# EAGLE design boneclamp_rC (EAGLE 6.4)

## Sheet 1 of 6: Beaglebone interface
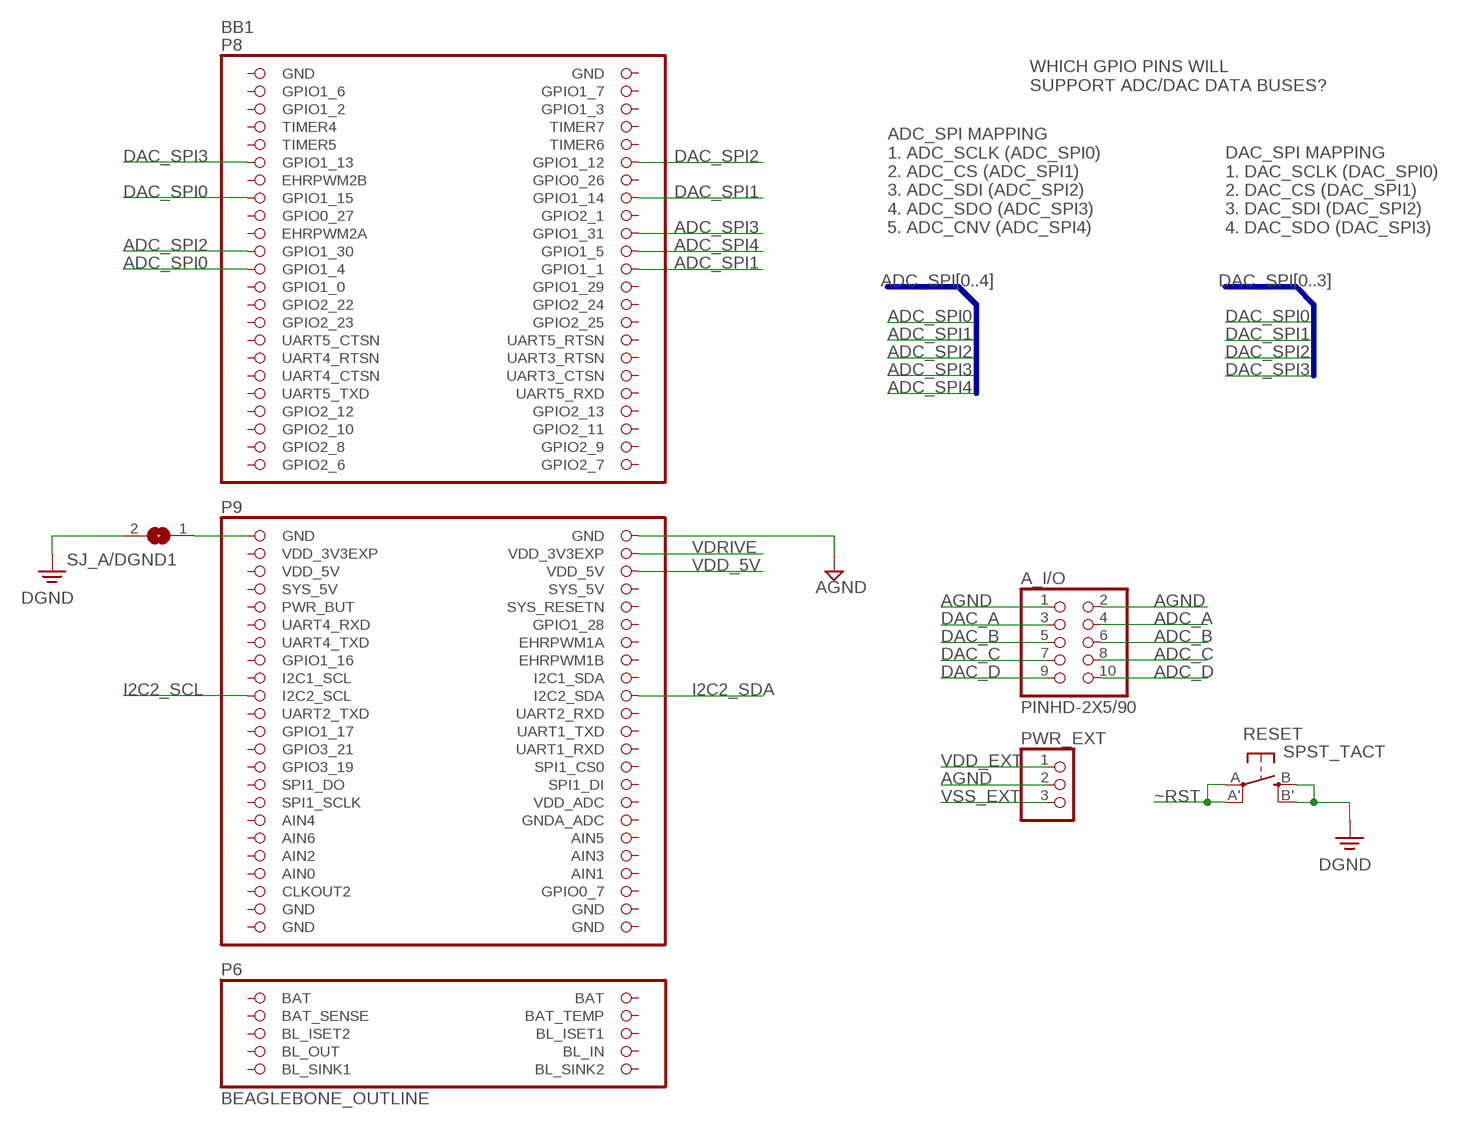
[diagram p0: schematic, sheet 1]

### Parts
A_I/O  PINHD-2X5/90  [2X05/90]
BB1  BEAGLEBONE_OUTLINE  [BEAGLEBONE_SHIELD]
PWR_EXT  PINHD-1X3  [1X03]
RESET  SPST_TACT  [EVQ-Q2-A]
SJ_A/DGND1  SJ  [SJ]

### Nets
ADC_A: A_I/O.4 ; also sheet 2
ADC_B: A_I/O.6 ; also sheet 2
ADC_C: A_I/O.8 ; also sheet 2
ADC_D: A_I/O.10 ; also sheet 2
ADC_SPI0: BB1.23(GPIO1_4) ; also sheet 2
ADC_SPI1: BB1.24(GPIO1_1) ; also sheet 2
ADC_SPI2: BB1.21(GPIO1_30) ; also sheet 2
ADC_SPI3: BB1.20(GPIO1_31) ; also sheet 2
ADC_SPI4: BB1.22(GPIO1_5) ; also sheet 2
AGND: A_I/O.1 A_I/O.2 BB1.48(GND) PWR_EXT.2 ; also sheet 2,3,4,5
DAC_A: A_I/O.3 ; also sheet 3
DAC_B: A_I/O.5 ; also sheet 3
DAC_C: A_I/O.7 ; also sheet 3
DAC_D: A_I/O.9 ; also sheet 3
DAC_SPI0: BB1.15(GPIO1_15) ; also sheet 3
DAC_SPI1: BB1.16(GPIO1_14) ; also sheet 3
DAC_SPI2: BB1.12(GPIO1_12) ; also sheet 3
DAC_SPI3: BB1.11(GPIO1_13) ; also sheet 3
DGND: RESET.B'(S1) RESET.B(S) SJ_A/DGND1.2 ; also sheet 2,3,4,6
I2C2_SCL: BB1.65(I2C2_SCL) ; also sheet 6
I2C2_SDA: BB1.66(I2C2_SDA) ; also sheet 6
N$8: BB1.47(GND) SJ_A/DGND1.1
VDD_5V: BB1.52(VDD_5V) ; also sheet 4
VDD_EXT: PWR_EXT.1 ; also sheet 4
VDRIVE: BB1.50(VDD_3V3EXP) ; also sheet 2,3,6
VSS_EXT: PWR_EXT.3 ; also sheet 4
~RST: RESET.A'(P1) RESET.A(P) ; also sheet 2,3
Unconnected: BB1.3(GPIO1_6) BB1.4(GPIO1_7) BB1.5(GPIO1_2) BB1.6(GPIO1_3) BB1.7(TIMER4) BB1.8(TIMER7) BB1.9(TIMER5) BB1.10(TIMER6) BB1.13(EHRPWM2B) BB1.14(GPIO0_26) BB1.17(GPIO0_27) BB1.18(GPIO2_1) BB1.19(EHRPWM2A) BB1.25(GPIO1_0) BB1.26(GPIO1_29) BB1.27(GPIO2_22) BB1.28(GPIO2_24) BB1.29(GPIO2_23) BB1.30(GPIO2_25) BB1.31(UART5_CTSN) BB1.32(UART5_RTSN) BB1.33(UART4_RTSN) BB1.34(UART3_RTSN) BB1.35(UART4_CTSN) BB1.36(UART3_CTSN) BB1.37(UART5_TXD) BB1.38(UART5_RXD) BB1.39(GPIO2_12) BB1.40(GPIO2_13) BB1.41(GPIO2_10) BB1.42(GPIO2_11) BB1.43(GPIO2_8) BB1.44(GPIO2_9) BB1.45(GPIO2_6) BB1.46(GPIO2_7) BB1.54(SYS_5V) BB1.55(PWR_BUT) BB1.56(SYS_RESETN) BB1.57(UART4_RXD) BB1.58(GPIO1_28) BB1.59(UART4_TXD) BB1.60(EHRPWM1A) BB1.61(GPIO1_16) BB1.62(EHRPWM1B) BB1.63(I2C1_SCL) BB1.64(I2C1_SDA) BB1.67(UART2_TXD) BB1.68(UART2_RXD) BB1.69(GPIO1_17) BB1.70(UART1_TXD) BB1.71(GPIO3_21) BB1.72(UART1_RXD) BB1.73(GPIO3_19) BB1.74(SPI1_CS0) BB1.75(SPI1_DO) BB1.76(SPI1_DI) BB1.77(SPI1_SCLK) BB1.78(VDD_ADC) BB1.79(AIN4) BB1.80(GNDA_ADC) BB1.81(AIN6) BB1.82(AIN5) BB1.83(AIN2) BB1.84(AIN3) BB1.86(AIN1) BB1.87(CLKOUT2) BB1.88(GPIO0_7) BB1.93(BAT) BB1.94(BAT) BB1.96(BAT_TEMP) BB1.98(BL_ISET1) BB1.99(BL_ISET2)

### Buses
ADC_SPI[0..4]
DAC_SPI[0..3]

### Notes on the sheet
- WHICH GPIO PINS WILL 
  SUPPORT ADC/DAC DATA BUSES?
- ADC_SPI MAPPING
  1. ADC_SCLK (ADC_SPI0)
  2. ADC_CS (ADC_SPI1)
  3. ADC_SDI (ADC_SPI2)
  4. ADC_SDO (ADC_SPI3)
  5. ADC_CNV (ADC_SPI4)
- DAC_SPI MAPPING
  1. DAC_SCLK (DAC_SPI0)
  2. DAC_CS (DAC_SPI1)
  3. DAC_SDI (DAC_SPI2)
  4. DAC_SDO (DAC_SPI3)

## Sheet 2 of 6: ADC
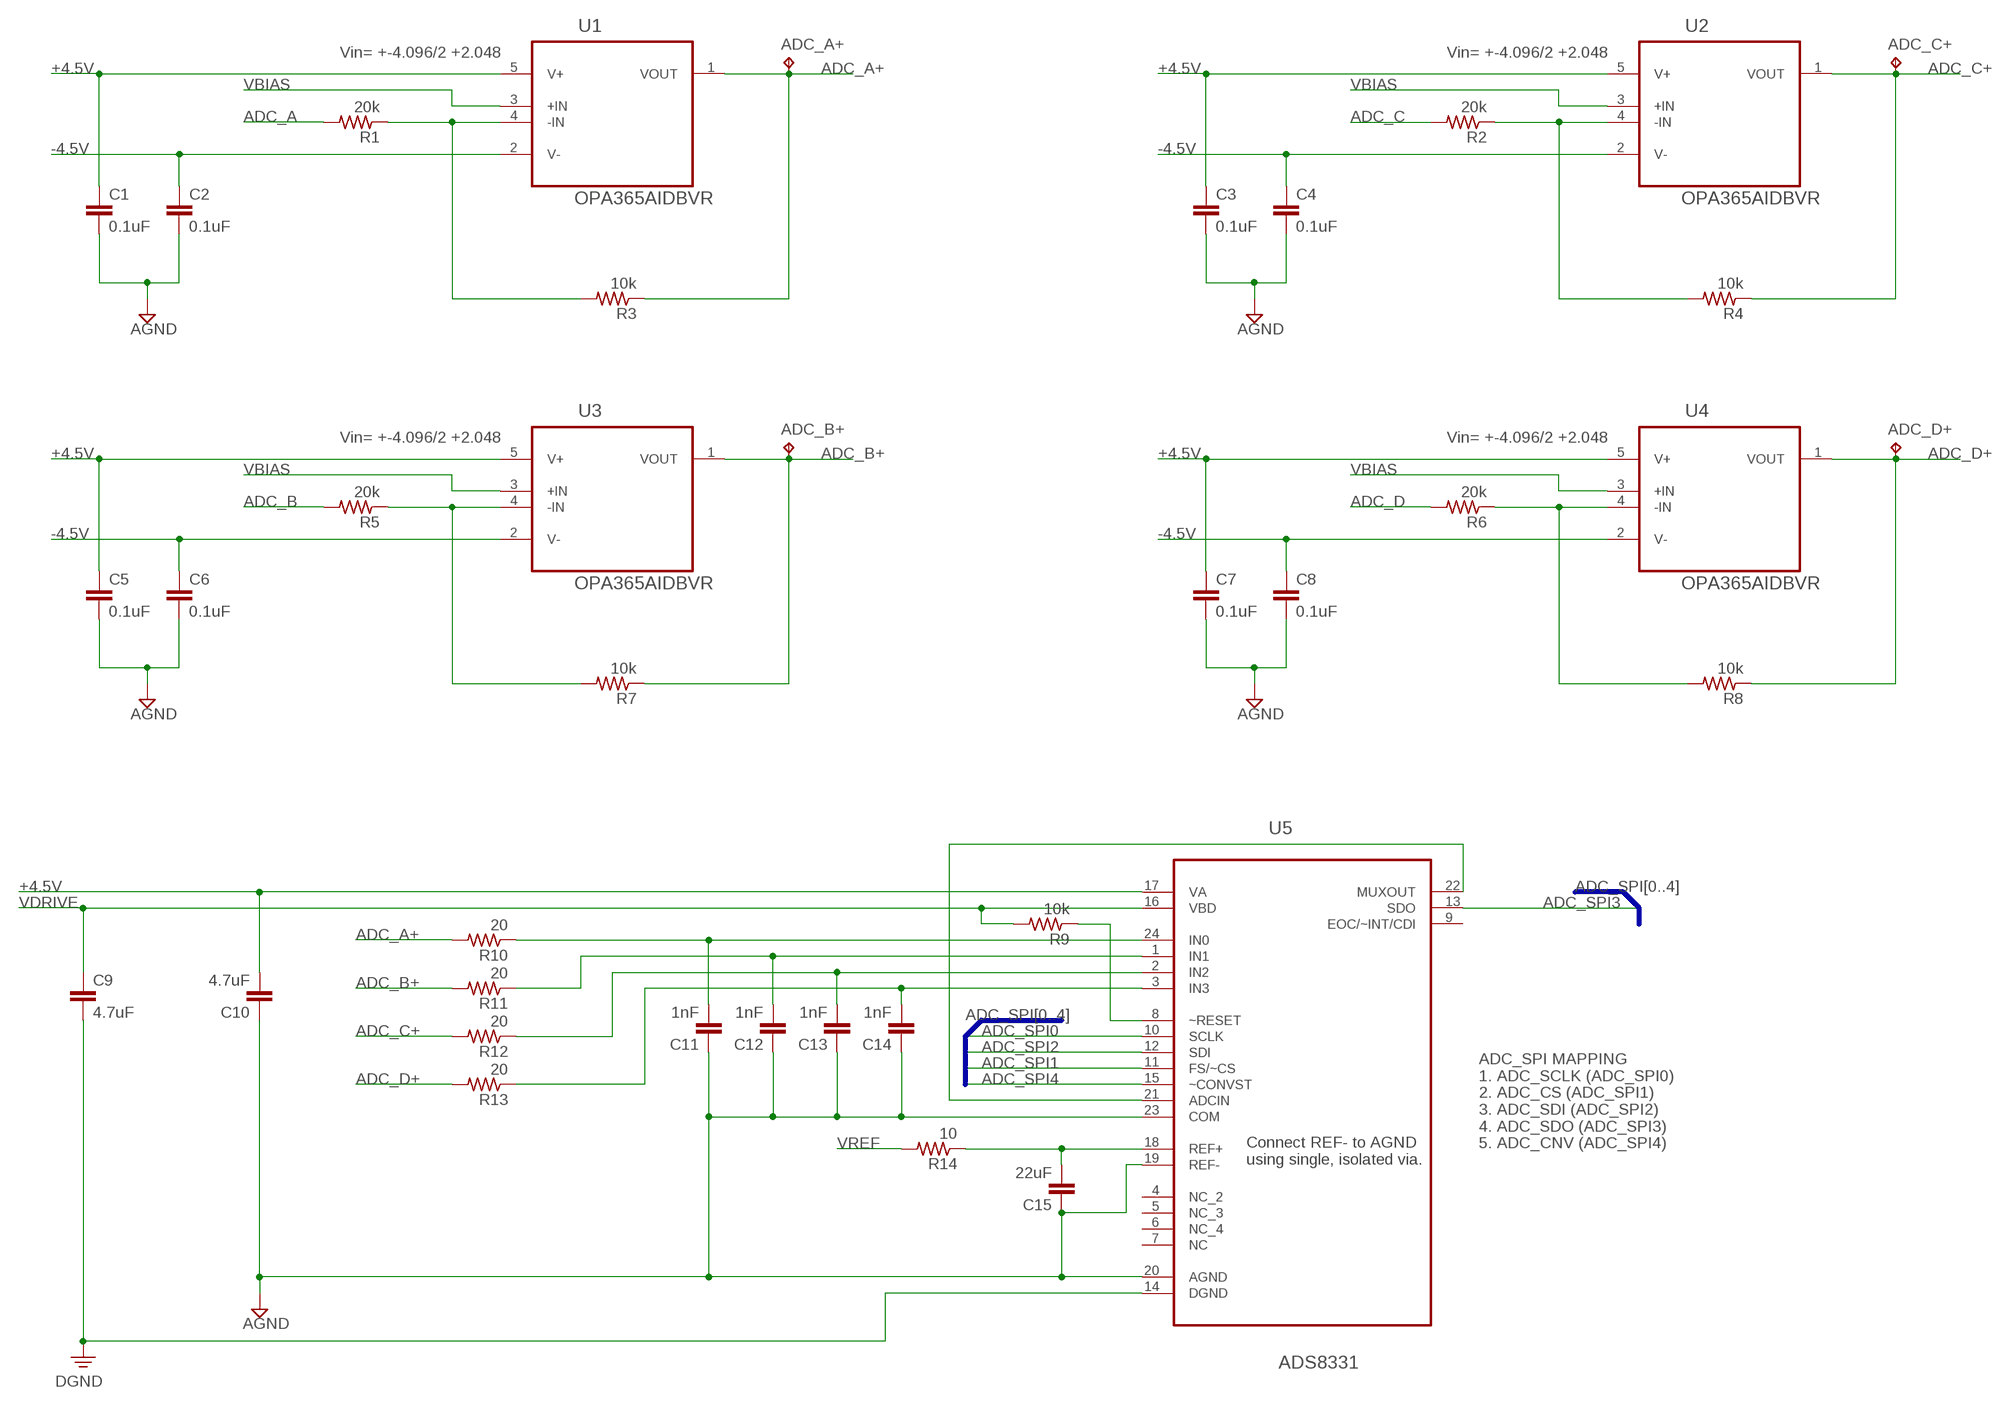
[diagram p1: schematic, sheet 2]

### Parts
ADC_A+  TPB1,27  [B1,27]
ADC_B+  TPB1,27  [B1,27]
ADC_C+  TPB1,27  [B1,27]
ADC_D+  TPB1,27  [B1,27]
C1  0.1uF  C-EUC0603  [C0603]
C2  0.1uF  C-EUC0603  [C0603]
C3  0.1uF  C-EUC0603  [C0603]
C4  0.1uF  C-EUC0603  [C0603]
C5  0.1uF  C-EUC0603  [C0603]
C6  0.1uF  C-EUC0603  [C0603]
C7  0.1uF  C-EUC0603  [C0603]
C8  0.1uF  C-EUC0603  [C0603]
C9  4.7uF  C-EUC0805  [C0805]
C10  4.7uF  C-EUC0805  [C0805]
C11  1nF  C-EUC0603  [C0603]
C12  1nF  C-EUC0603  [C0603]
C13  1nF  C-EUC0603  [C0603]
C14  1nF  C-EUC0603  [C0603]
C15  22uF  C-EUC0603  [C0603]
R1  20k  R-US_R0603  [R0603]
R2  20k  R-US_R0603  [R0603]
R3  10k  R-US_R0603  [R0603]
R4  10k  R-US_R0603  [R0603]
R5  20k  R-US_R0603  [R0603]
R6  20k  R-US_R0603  [R0603]
R7  10k  R-US_R0603  [R0603]
R8  10k  R-US_R0603  [R0603]
R9  10k  R-US_R0603  [R0603]
R10  20  R-US_R0603  [R0603]
R11  20  R-US_R0603  [R0603]
R12  20  R-US_R0603  [R0603]
R13  20  R-US_R0603  [R0603]
R14  10  R-US_R0603  [R0603]
U1  OPA365AIDBVR  [SOT95P280X145-5N]
U2  OPA365AIDBVR  [SOT95P280X145-5N]
U3  OPA365AIDBVR  [SOT95P280X145-5N]
U4  OPA365AIDBVR  [SOT95P280X145-5N]
U5  ADS8331  ADS8331IBPW  [SOP65P640X120-24N]

### Nets
+4.5V: C1.1 C3.1 C5.1 C7.1 C10.2 U1.5(V+) U2.5(V+) U3.5(V+) U4.5(V+) U5.17(VA) ; also sheet 3,4,5
-4.5V: C2.1 C4.1 C6.1 C8.1 U1.2(V-) U2.2(V-) U3.2(V-) U4.2(V-) ; also sheet 3,4
ADC_A: R1.2 ; also sheet 1
ADC_A+: ADC_A+.TP R3.1 R10.2 U1.1(VOUT)
ADC_B: R5.2 ; also sheet 1
ADC_B+: ADC_B+.TP R7.1 R11.2 U3.1(VOUT)
ADC_C: R2.2 ; also sheet 1
ADC_C+: ADC_C+.TP R4.1 R12.2 U2.1(VOUT)
ADC_D: R6.2 ; also sheet 1
ADC_D+: ADC_D+.TP R8.1 R13.2 U4.1(VOUT)
ADC_SPI0: U5.10(SCLK) ; also sheet 1
ADC_SPI1: U5.11(FS/~CS) ; also sheet 1
ADC_SPI2: U5.12(SDI) ; also sheet 1
ADC_SPI3: U5.13(SDO) ; also sheet 1
ADC_SPI4: U5.15(~CONVST) ; also sheet 1
AGND: C1.2 C2.2 C3.2 C4.2 C5.2 C6.2 C7.2 C8.2 C10.1 C11.1 C12.1 C13.1 C14.1 C15.1 U5.19(REF-) U5.20(AGND) U5.23(COM) ; also sheet 1,3,4,5
DGND: C9.2 U5.14(DGND) ; also sheet 1,3,4,6
N$3: R1.1 R3.2 U1.4(-IN)
N$6: R5.1 R7.2 U3.4(-IN)
N$13: R2.1 R4.2 U2.4(-IN)
N$15: R6.1 R8.2 U4.4(-IN)
N$16: C15.2 R14.1 U5.18(REF+)
N$24: U5.21(ADCIN) U5.22(MUXOUT)
N$40: C11.2 R10.1 U5.24(IN0)
N$41: C12.2 R11.1 U5.1(IN1)
N$42: C13.2 R12.1 U5.2(IN2)
N$43: C14.2 R13.1 U5.3(IN3)
VBIAS: U1.3(+IN) U2.3(+IN) U3.3(+IN) U4.3(+IN) ; also sheet 5
VDRIVE: C9.1 R9.2 U5.16(VBD) ; also sheet 1,3,6
VREF: R14.2 ; also sheet 3,5
~RST: R9.1 U5.8(~RESET) ; also sheet 1,3
Unconnected: U5.4(NC_2) U5.5(NC_3) U5.6(NC_4) U5.7(NC) U5.9(EOC/~INT/CDI)

### Buses
ADC_SPI[0..4]

### Notes on the sheet
- Vin= +-4.096/2 +2.048 | Vin= +-4.096/2 +2.048
- Vin= +-4.096/2 +2.048 | Vin= +-4.096/2 +2.048
- ADC_SPI MAPPING
  1. ADC_SCLK (ADC_SPI0)
  2. ADC_CS (ADC_SPI1)
  3. ADC_SDI (ADC_SPI2)
  4. ADC_SDO (ADC_SPI3)
  5. ADC_CNV (ADC_SPI4)
- Connect REF- to AGND 
  using single, isolated via.

## Sheet 3 of 6: DAC
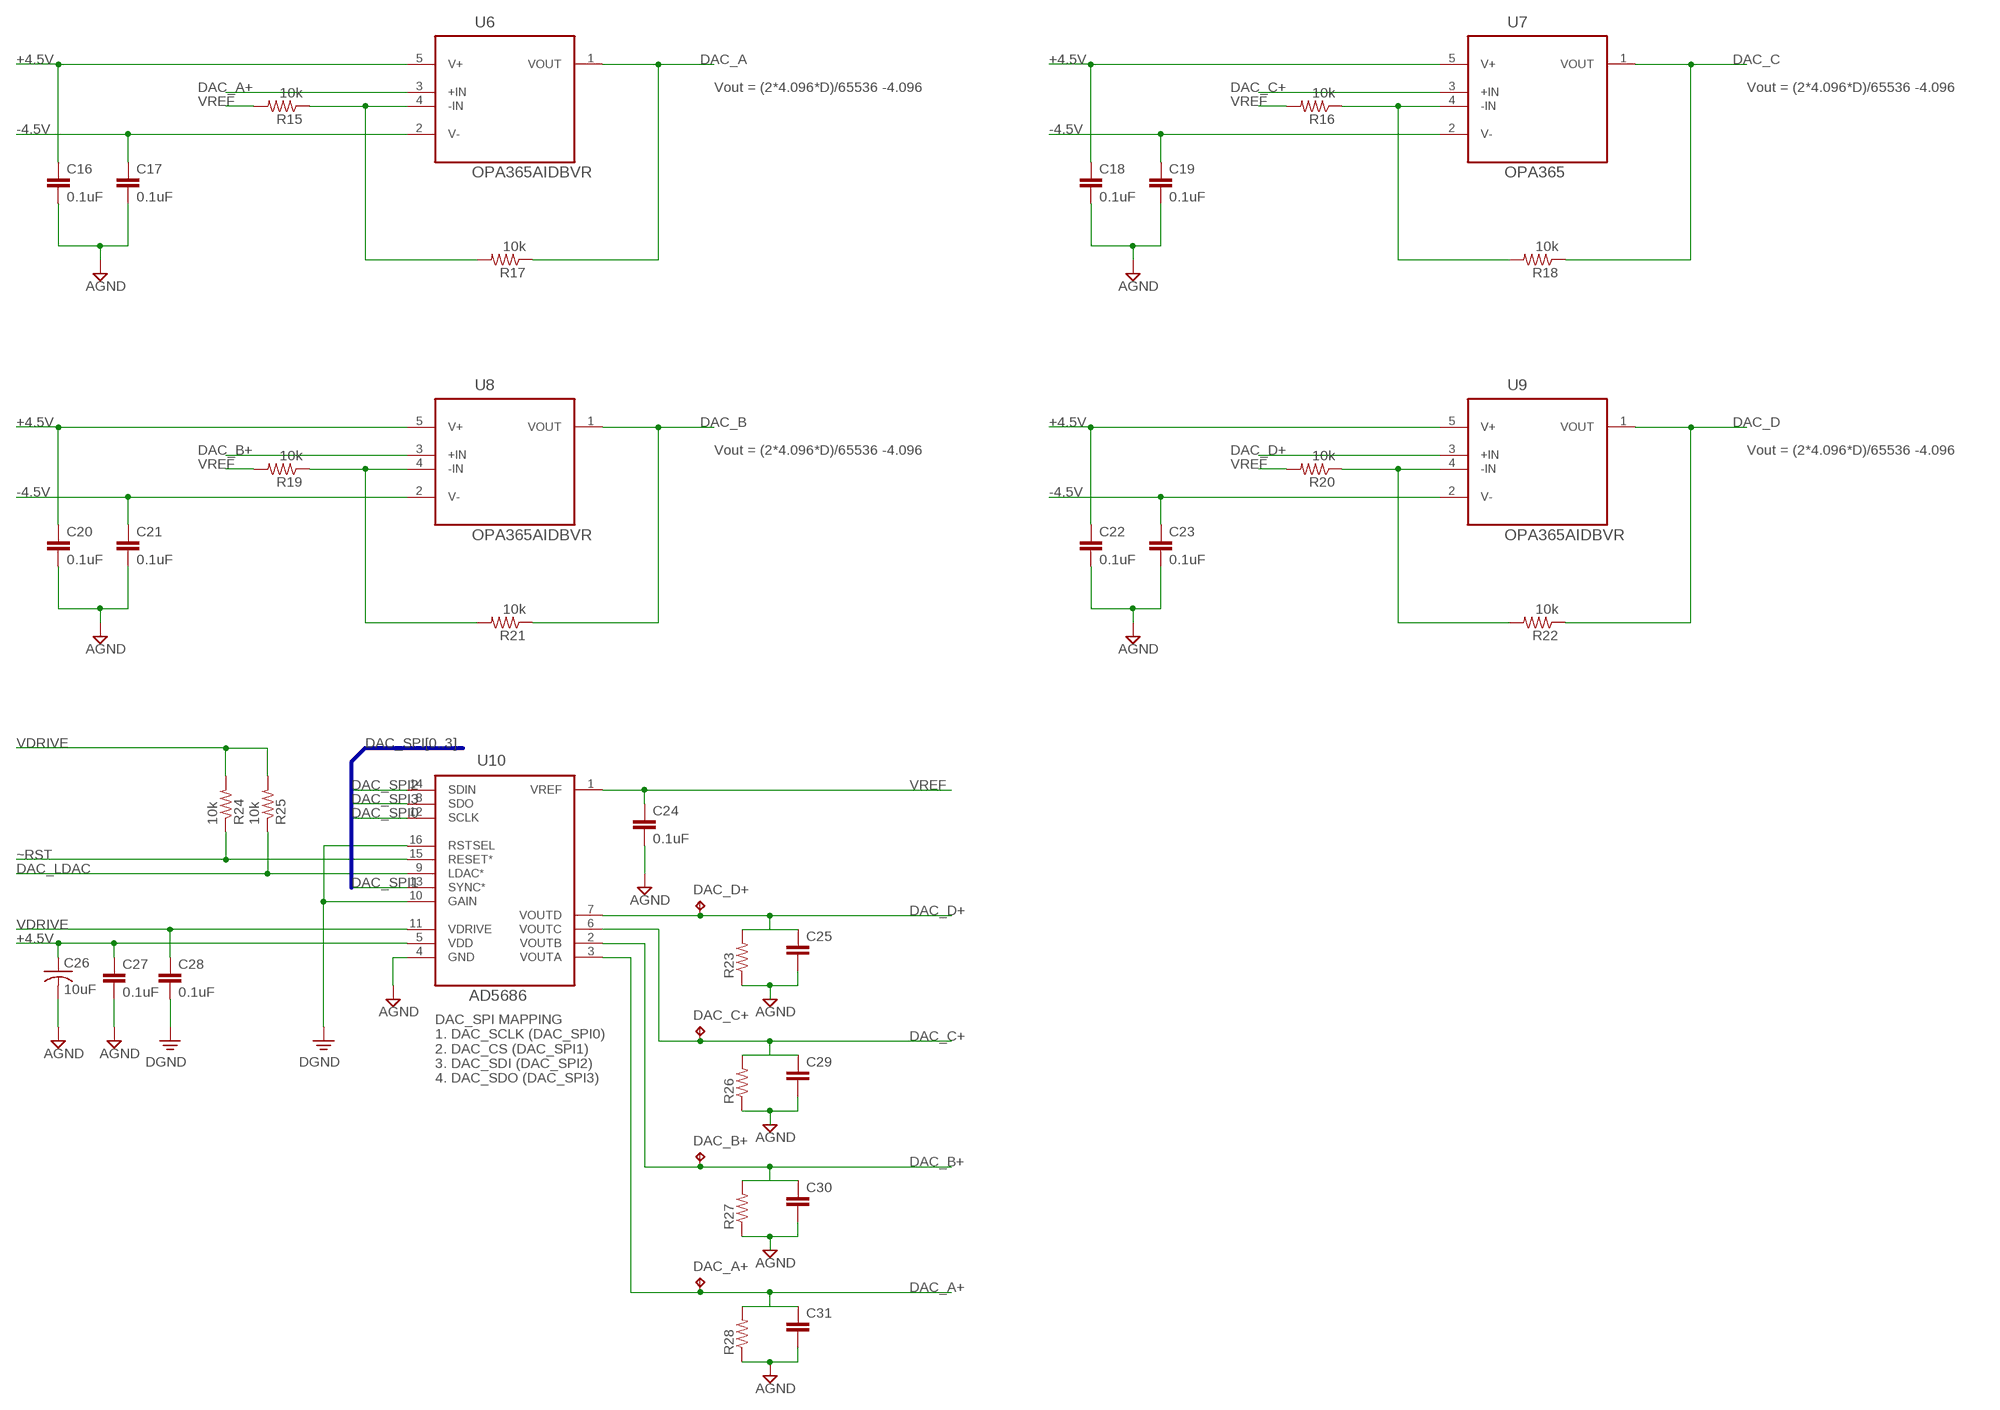
[diagram p2: schematic, sheet 3]

### Parts
C16  0.1uF  C-EUC0603  [C0603]
C17  0.1uF  C-EUC0603  [C0603]
C18  0.1uF  C-EUC0603  [C0603]
C19  0.1uF  C-EUC0603  [C0603]
C20  0.1uF  C-EUC0603  [C0603]
C21  0.1uF  C-EUC0603  [C0603]
C22  0.1uF  C-EUC0603  [C0603]
C23  0.1uF  C-EUC0603  [C0603]
C24  0.1uF  C-EUC0603  [C0603]
C25  C-EUC0603  [C0603]
C26  10uF  C-USC0805  [C0805]
C27  0.1uF  C-EUC0603  [C0603]
C28  0.1uF  C-EUC0603  [C0603]
C29  C-EUC0603  [C0603]
C30  C-EUC0603  [C0603]
C31  C-EUC0603  [C0603]
DAC_A+  TPB1,27  [B1,27]
DAC_B+  TPB1,27  [B1,27]
DAC_C+  TPB1,27  [B1,27]
DAC_D+  TPB1,27  [B1,27]
R15  10k  R-US_R0603  [R0603]
R16  10k  R-US_R0603  [R0603]
R17  10k  R-US_R0603  [R0603]
R18  10k  R-US_R0603  [R0603]
R19  10k  R-US_R0603  [R0603]
R20  10k  R-US_R0603  [R0603]
R21  10k  R-US_R0603  [R0603]
R22  10k  R-US_R0603  [R0603]
R23  R-US_R0603  [R0603]
R24  10k  R-US_R0603  [R0603]
R25  10k  R-US_R0603  [R0603]
R26  R-US_R0603  [R0603]
R27  R-US_R0603  [R0603]
R28  R-US_R0603  [R0603]
U6  OPA365AIDBVR  [SOT95P280X145-5N]
U7  OPA365  OPA365AIDBVR  [SOT95P280X145-5N]
U8  OPA365AIDBVR  [SOT95P280X145-5N]
U9  OPA365AIDBVR  [SOT95P280X145-5N]
U10  AD5686  AD5686RARUZ  [MO-153-AB]

### Nets
+4.5V: C16.1 C18.1 C20.1 C22.1 C26.1 C27.1 U6.5(V+) U7.5(V+) U8.5(V+) U9.5(V+) U10.5(VDD) ; also sheet 2,4,5
-4.5V: C17.1 C19.1 C21.1 C23.1 U6.2(V-) U7.2(V-) U8.2(V-) U9.2(V-) ; also sheet 2,4
AGND: C16.2 C17.2 C18.2 C19.2 C20.2 C21.2 C22.2 C23.2 C24.2 C25.2 C26.2 C27.2 C29.2 C30.2 C31.2 R23.1 R26.1 R27.1 R28.1 U10.4(GND) ; also sheet 1,2,4,5
DAC_A: R17.1 U6.1(VOUT) ; also sheet 1
DAC_A+: C31.1 DAC_A+.TP R28.2 U6.3(+IN) U10.3(VOUTA)
DAC_B: R21.1 U8.1(VOUT) ; also sheet 1
DAC_B+: C30.1 DAC_B+.TP R27.2 U8.3(+IN) U10.2(VOUTB)
DAC_C: R18.1 U7.1(VOUT) ; also sheet 1
DAC_C+: C29.1 DAC_C+.TP R26.2 U7.3(+IN) U10.6(VOUTC)
DAC_D: R22.1 U9.1(VOUT) ; also sheet 1
DAC_D+: C25.1 DAC_D+.TP R23.2 U9.3(+IN) U10.7(VOUTD)
DAC_LDAC: R25.1 U10.9(LDAC*)
DAC_SPI0: U10.12(SCLK) ; also sheet 1
DAC_SPI1: U10.13(SYNC*) ; also sheet 1
DAC_SPI2: U10.14(SDIN) ; also sheet 1
DAC_SPI3: U10.8(SDO) ; also sheet 1
DGND: C28.2 U10.10(GAIN) U10.16(RSTSEL) ; also sheet 1,2,4,6
N$1: R16.1 R18.2 U7.4(-IN)
N$2: R19.1 R21.2 U8.4(-IN)
N$10: R20.1 R22.2 U9.4(-IN)
N$39: R15.1 R17.2 U6.4(-IN)
VDRIVE: C28.1 R24.2 R25.2 U10.11(VDRIVE) ; also sheet 1,2,6
VREF: C24.1 R15.2 R16.2 R19.2 R20.2 U10.1(VREF) ; also sheet 2,5
~RST: R24.1 U10.15(RESET*) ; also sheet 1,2

### Buses
DAC_SPI[0..3]

### Notes on the sheet
- Vout = (2*4.096*D)/65536 -4.096 | Vout = (2*4.096*D)/65536 -4.096
- Vout = (2*4.096*D)/65536 -4.096 | Vout = (2*4.096*D)/65536 -4.096
- DAC_SPI MAPPING
  1. DAC_SCLK (DAC_SPI0)
  2. DAC_CS (DAC_SPI1)
  3. DAC_SDI (DAC_SPI2)
  4. DAC_SDO (DAC_SPI3)

## Sheet 4 of 6: POWER
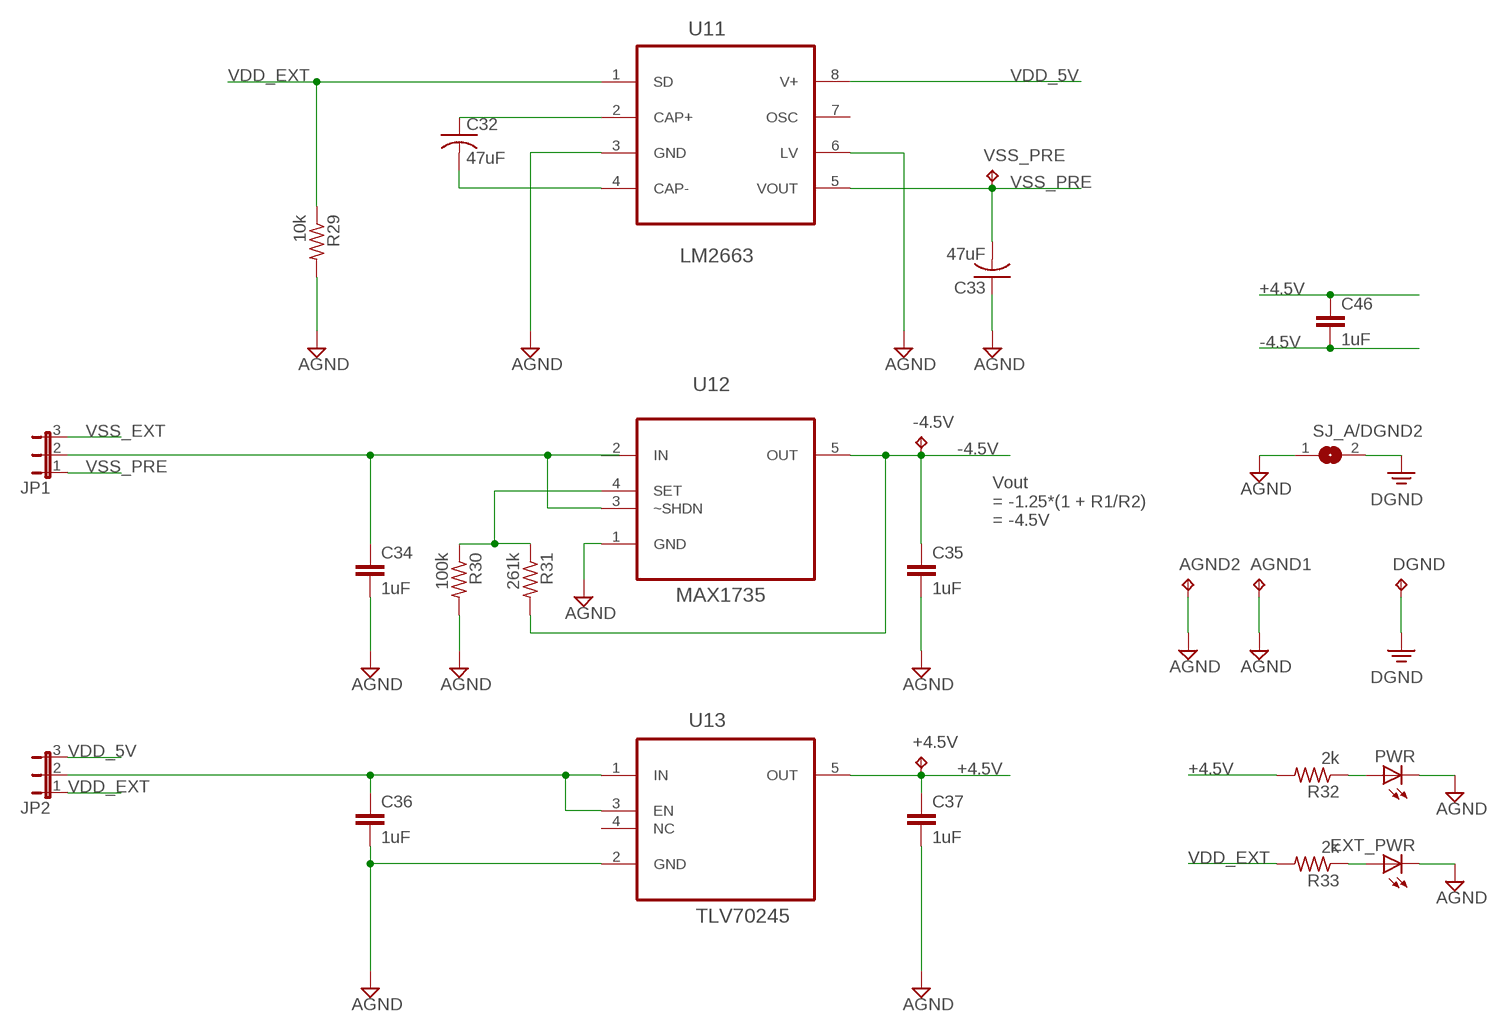
[diagram p3: schematic, sheet 4]

### Parts
+4.5V  TPPAD1-17  [P1-17]
-4.5V  TPB1,27  [B1,27]
AGND1  TPPAD1-17  [P1-17]
AGND2  TPPAD1-17  [P1-17]
C32  47uF  C-USC1206  [C1206]
C33  47uF  C-USC1206  [C1206]
C34  1uF  C-EUC0603  [C0603]
C35  1uF  C-EUC0603  [C0603]
C36  1uF  C-EUC0603  [C0603]
C37  1uF  C-EUC0603  [C0603]
C46  1uF  C-EUC0603  [C0603]
DGND  TPPAD1-17  [P1-17]
EXT_PWR  LEDCHIPLED_0805  [CHIPLED_0805]
JP1  JP2E  [JP2]
JP2  JP2E  [JP2]
PWR  LEDCHIPLED_0805  [CHIPLED_0805]
R29  10k  R-US_R0603  [R0603]
R30  100k  R-US_R0603  [R0603]
R31  261k  R-US_R0603  [R0603]
R32  2k  R-US_R0603  [R0603]
R33  2k  R-US_R0603  [R0603]
SJ_A/DGND2  SJ  [SJ]
U11  LM2663  [SOIC127P600X175-8N]
U12  MAX1735  MAX1735EUK25+T  [SOT95P280X145-5N]
U13  TLV70245  TLV70025DDCR  [SOT95P280X110-5N]
VSS_PRE  TPB1,27  [B1,27]

### Nets
+4.5V: +4.5V.TP C37.1 C46.1 R32.2 U13.5(OUT) ; also sheet 2,3,5
-4.5V: -4.5V.TP C35.1 C46.2 R31.2 U12.5(OUT) ; also sheet 2,3
AGND: AGND1.TP AGND2.TP C33.1 C34.2 C35.2 C36.2 C37.2 EXT_PWR.C PWR.C R29.2 R30.2 SJ_A/DGND2.1 U11.3(GND) U11.6(LV) U12.1(GND) U13.2(GND) ; also sheet 1,2,3,5
DGND: DGND.TP SJ_A/DGND2.2 ; also sheet 1,2,3,6
N$5: R30.1 R31.1 U12.4(SET)
N$7: EXT_PWR.A R33.1
N$11: C36.1 JP2.2 U13.1(IN) U13.3(EN)
N$20: PWR.A R32.1
N$23: C34.1 JP1.2 U12.3(~SHDN)
N$33: C32.1 U11.2(CAP+)
N$34: C32.2 U11.4(CAP-)
VDD_5V: JP2.3 U11.8(V+) ; also sheet 1
VDD_EXT: JP2.1 R29.1 R33.2 U11.1(SD) ; also sheet 1
VSS_EXT: JP1.3 ; also sheet 1
VSS_PRE: C33.2 JP1.1 U11.5(VOUT) VSS_PRE.TP
Unconnected: U11.7(OSC) U12.2(IN) U13.4(NC)

### Notes on the sheet
- Vout 
  = -1.25*(1 + R1/R2) 
  = -4.5V

## Sheet 5 of 6: VREF
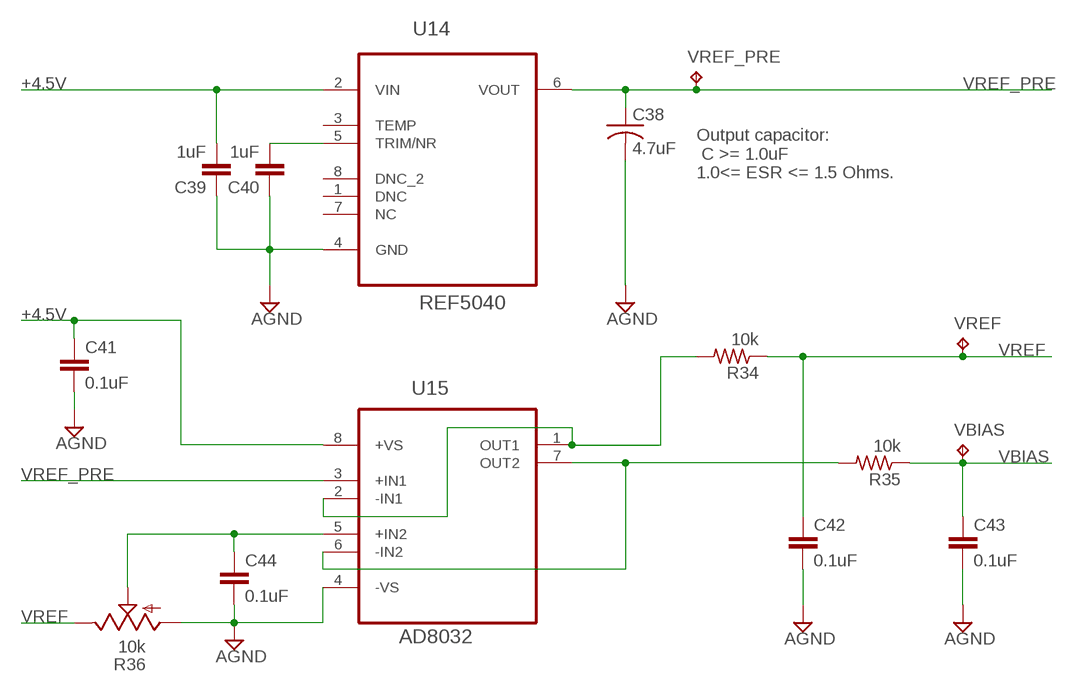
[diagram p4: schematic, sheet 5]

### Parts
C38  4.7uF  C-USC1206  [C1206]
C39  1uF  C-EUC0603  [C0603]
C40  1uF  C-EUC0603  [C0603]
C41  0.1uF  C-EUC0603  [C0603]
C42  0.1uF  C-EUC0603  [C0603]
C43  0.1uF  C-EUC0603  [C0603]
C44  0.1uF  C-EUC0603  [C0603]
R34  10k  R-US_R0603  [R0603]
R35  10k  R-US_R0603  [R0603]
R36  10k  TRIM_US-M84W  [M84W-TRIMMER]
U14  REF5040  REF5040MDREP  [SOIC127P600X175-8N]
U15  AD8032  AD8032ARZ-REEL7  [SOIC127P600X175-8N]
VBIAS  TPB1,27  [B1,27]
VREF  TPB1,27  [B1,27]
VREF_PRE  TPB1,27  [B1,27]

### Nets
+4.5V: C39.2 C41.1 U14.2(VIN) U15.8(+VS) ; also sheet 2,3,4
AGND: C38.2 C39.1 C40.1 C41.2 C42.2 C43.2 C44.2 R36.3(A) U14.4(GND) U15.4(-VS) ; also sheet 1,2,3,4
N$4: C44.1 R36.2(S) U15.5(+IN2)
N$9: R35.2 U15.6(-IN2) U15.7(OUT2)
N$12: R34.2 U15.1(OUT1) U15.2(-IN1)
N$32: C40.2 U14.5(TRIM/NR)
VBIAS: C43.1 R35.1 VBIAS.TP ; also sheet 2
VREF: C42.1 R34.1 R36.1(E) VREF.TP ; also sheet 2,3
VREF_PRE: C38.1 U14.6(VOUT) U15.3(+IN1) VREF_PRE.TP
Unconnected: U14.1(DNC) U14.3(TEMP) U14.7(NC) U14.8(DNC_2)

### Notes on the sheet
- Output capacitor:
   C >= 1.0uF 
  1.0<= ESR <= 1.5 Ohms.

## Sheet 6 of 6: BOARD ID
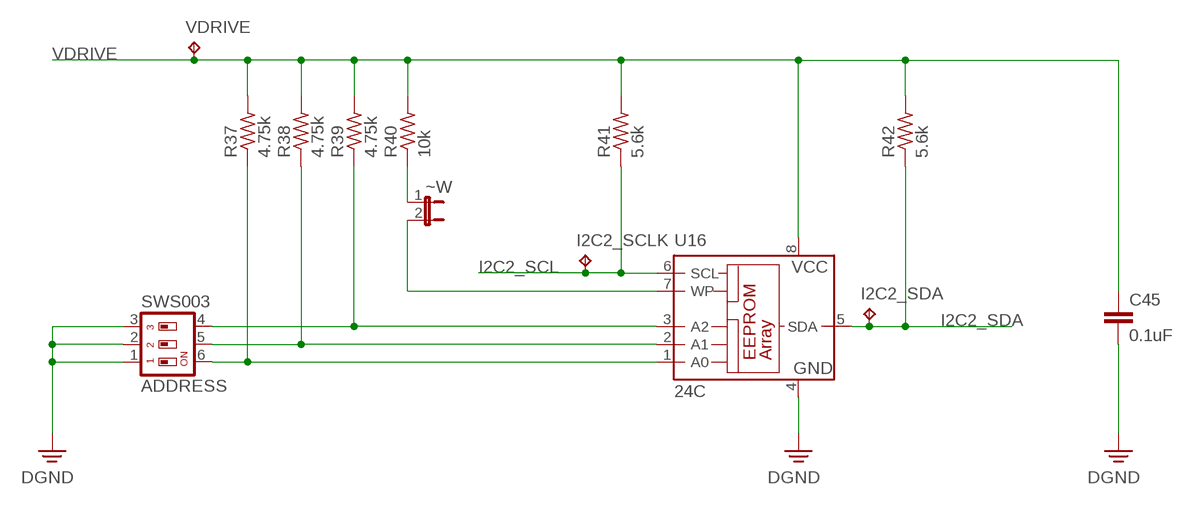
[diagram p5: schematic, sheet 6]

### Parts
ADDRESS  SWS003  [SMS-003]
C45  0.1uF  C-EUC0603  [C0603]
I2C2_SCLK  TPB1,27  [B1,27]
I2C2_SDA  TPB1,27  [B1,27]
R37  4.75k  R-US_R0603  [R0603]
R38  4.75k  R-US_R0603  [R0603]
R39  4.75k  R-US_R0603  [R0603]
R40  10k  R-US_R0603  [R0603]
R41  5.6k  R-US_R0603  [R0603]
R42  5.6k  R-US_R0603  [R0603]
U16  24C  [SO-08]
VDRIVE  TPPAD1-17  [P1-17]
~W  JP1E  [JP1]

### Nets
DGND: ADDRESS.1 ADDRESS.2 ADDRESS.3 C45.2 U16.4(GND) ; also sheet 1,2,3,4
I2C2_SCL: I2C2_SCLK.TP R41.1 U16.6(SCL) ; also sheet 1
I2C2_SDA: I2C2_SDA.TP R42.1 U16.5(SDA) ; also sheet 1
N$14: ADDRESS.6 R37.1 U16.1(A0)
N$18: ADDRESS.5 R38.1 U16.2(A1)
N$19: ADDRESS.4 R39.1 U16.3(A2)
N$21: U16.7(WP) ~W.2
N$22: R40.1 ~W.1
VDRIVE: C45.1 R37.2 R38.2 R39.2 R40.2 R41.2 R42.2 U16.8(VCC) VDRIVE.TP ; also sheet 1,2,3

## Power pins joined to a net without a drawn wire
AIN0: BB1.85(AIN0)
BAT_SENSE: BB1.95(BAT_SENSE)
BL_IN: BB1.97(BL_IN)
BL_OUT: BB1.100(BL_OUT)
BL_SINK1: BB1.101(BL_SINK1)
BL_SINK2: BB1.102(BL_SINK2)
GND: BB1.1(GND) BB1.2(GND) BB1.89(GND) BB1.90(GND) BB1.91(GND) BB1.92(GND)
SYS_5V: BB1.53(SYS_5V)
VDD_3V3EXP: BB1.49(VDD_3V3EXP)
VDD_5V: BB1.51(VDD_5V)

## Library data of the parts
+4.5V -4.5V ADC_A+ ADC_B+ ADC_C+ ADC_D+ AGND1 AGND2 DAC_A+ DAC_B+ DAC_C+ DAC_D+ DGND I2C2_SCLK I2C2_SDA VBIAS VDRIVE VREF VREF_PRE VSS_PRE = testpad:TP: Test pad
A_I/O = adafruit:PINHD-2X5
ADDRESS = smd-special:SWS003: SMD Dip Switch 3 pol.
BB1 = adafruit:BEAGLEBONE_OUTLINE: Should match A3 pinout - but not completely tested
C1-C25 C27-C31 C34-C37 C39-C46 = rcl:C-EU: CAPACITOR, European symbol
C26 C32 C33 C38 = rcl:C-US: CAPACITOR, American symbol
EXT_PWR PWR = led:LED: LED OSRAM: - CHIPLED LG R971, LG N971, LY N971, LG Q971, LY Q971, LO R971, LY R971 LH N974, LH R974 LS Q976, LO Q976, LY Q976 LO Q996 - Hyper CHIPLED LW Q18S LB Q993, LB Q99A, LB R99A - SideLED LS A670, LO A670, LY A670, LG A670, LP A670 LB A673, LV A673, LT A673, LW A673 LH A674 LY A675 LS A676, LA A676, LO A676, LY A676, LW A676 LS A679, LY A679, LG A679 - Hyper Micro SIDELED® LS Y876, LA Y876, LO Y876, LY Y876 LT Y87S - SmartLED LW L88C, LW L88S LB L89C, LB L89S, LG L890 LS L89K, LO L89K, LY L89K LS L896, LA L896, LO L896, LY L896 - TOPLED LS T670, LO T670, LY T670, LG T670, LP T670 LSG T670, LSP T670, LSY T670, LOP T670, LYG T670 LG T671, LOG T671, LSG T671 LB T673, LV T673, LT T673, LW T673 LH T674 LS T676, LA T676, LO T676, LY T676, LB T676, LH T676, LSB T676, LW T676 LB T67C, LV T67C, LT T67C, LS T67K, LO T67K, LY T67K, LW E67C LS E67B, LA E67B, LO E67B, LY E67B, LB E67C, LV E67C, LT E67C LW T67C LS T679, LY T679, LG T679 LS T770, LO T770, LY T770, LG T770, LP T770 LB T773, LV T773, LT T773, LW T773 LH T774 LS E675, LA E675, LY E675, LS T675 LS T776, LA T776, LO T776, LY T776, LB T776 LHGB T686 LT T68C, LB T68C - Hyper Mini TOPLED® LB M676 - Mini TOPLED Santana® LG M470 LS M47K, LO M47K, LY M47K Source: http://www.osram.convergy.de LUXEON: - LUMILED® LXK2-PW12-R00, LXK2-PW12-S00, LXK2-PW14-U00, LXK2-PW14-V00 LXK2-PM12-R00, LXK2-PM12-S00, LXK2-PM14-U00 LXK2-PE12-Q00, LXK2-PE12-R00, LXK2-PE12-S00, LXK2-PE14-T00, LXK2-PE14-U00 LXK2-PB12-K00, LXK2-PB12-L00, LXK2-PB12-M00, LXK2-PB14-N00, LXK2-PB14-P00, LXK2-PB14-Q00 LXK2-PR12-L00, LXK2-PR12-M00, LXK2-PR14-Q00, LXK2-PR14-R00 LXK2-PD12-Q00, LXK2-PD12-R00, LXK2-PD12-S00 LXK2-PH12-R00, LXK2-PH12-S00 LXK2-PL12-P00, LXK2-PL12-Q00, LXK2-PL12-R00 Source: www.luxeon.com KINGBRIGHT: KA-3528ASYC Source: www.kingbright.com
JP1 JP2 = jumper:JP2E: JUMPER
PWR_EXT = adafruit:PINHD-1X3: PIN HEADER
R1-R35 R37-R42 = rcl:R-US_: RESISTOR, American symbol
R36 = boneclamp:TRIM_US-: POTENTIOMETER
RESET = adafruit:SPST_TACT: SMT 6mm switch, EVQQ2 series http://www.ladyada.net/library/eagle
SJ_A/DGND1 SJ_A/DGND2 = jumper:SJ: SMD solder JUMPER
U1-U4 U6-U9 = ti-extended:OPA365AIDBVR: 50MHz, Low-Distortion, High CMRR RRI/O, Single-Supply OPERATIONAL AMPLIFIER; MPN: OPA365AIDBVR; OC_FARNELL: -; OC_NEWARK: 03M9400; PACKAGE: SOT-23-5; SUPPLIER: Texas Instruments
U5 = ti-extended:ADS8331IBPW: ADC; MPN: ADS8331IBPW; OC_FARNELL: 1882255; OC_NEWARK: 27T6163; PACKAGE: TSSOP-24; SUPPLIER: Texas Instruments
U10 = analog-devices-02:AD5686RARUZ
U11 = ti-extended:LM2663
U12 = Maxim_By_element14_Batch_1:MAX1735EUK25+T: 200mA, Negative-Output, Low-Dropout Linear Regulator in SOT23; MPN: MAX1735EUK25+T; OC_FARNELL: -; OC_NEWARK: 68K9417; PACKAGE: SOT-23-5; SUPPLIER: Maxim
U13 = ti-extended:TLV70025DDCR: 200-mA, Low-IQ, Low-Dropout Regulator for Portable Devices; MPN: TLV70025DDCR; OC_FARNELL: -; OC_NEWARK: 64R0678; PACKAGE: TSOT-23-5; SUPPLIER: Texas Instruments
U14 = ti-extended:REF5040MDREP: LOW-NOISE, VERY LOW DRIFT, PRECISION VOLTAGE REFERENCE; MPN: REF5040MDREP; OC_FARNELL: -; OC_NEWARK: 79R8283; PACKAGE: SOIC-8; SUPPLIER: Texas Instruments
U15 = analog-devices-02:AD8032ARZ-REEL7: Rail-to-Rail I/O Amplifiers; MPN: AD8032ARZ-REEL7; OC_FARNELL: unknown; OC_NEWARK: 82H2954; PACKAGE: SOIC-8; SUPPLIER: Analog Devices
U16 = on-semiconductor-01:24C*: Serial EEPROM 1 K/2 K/4 K
~W = jumper:JP1E: JUMPER

## Board
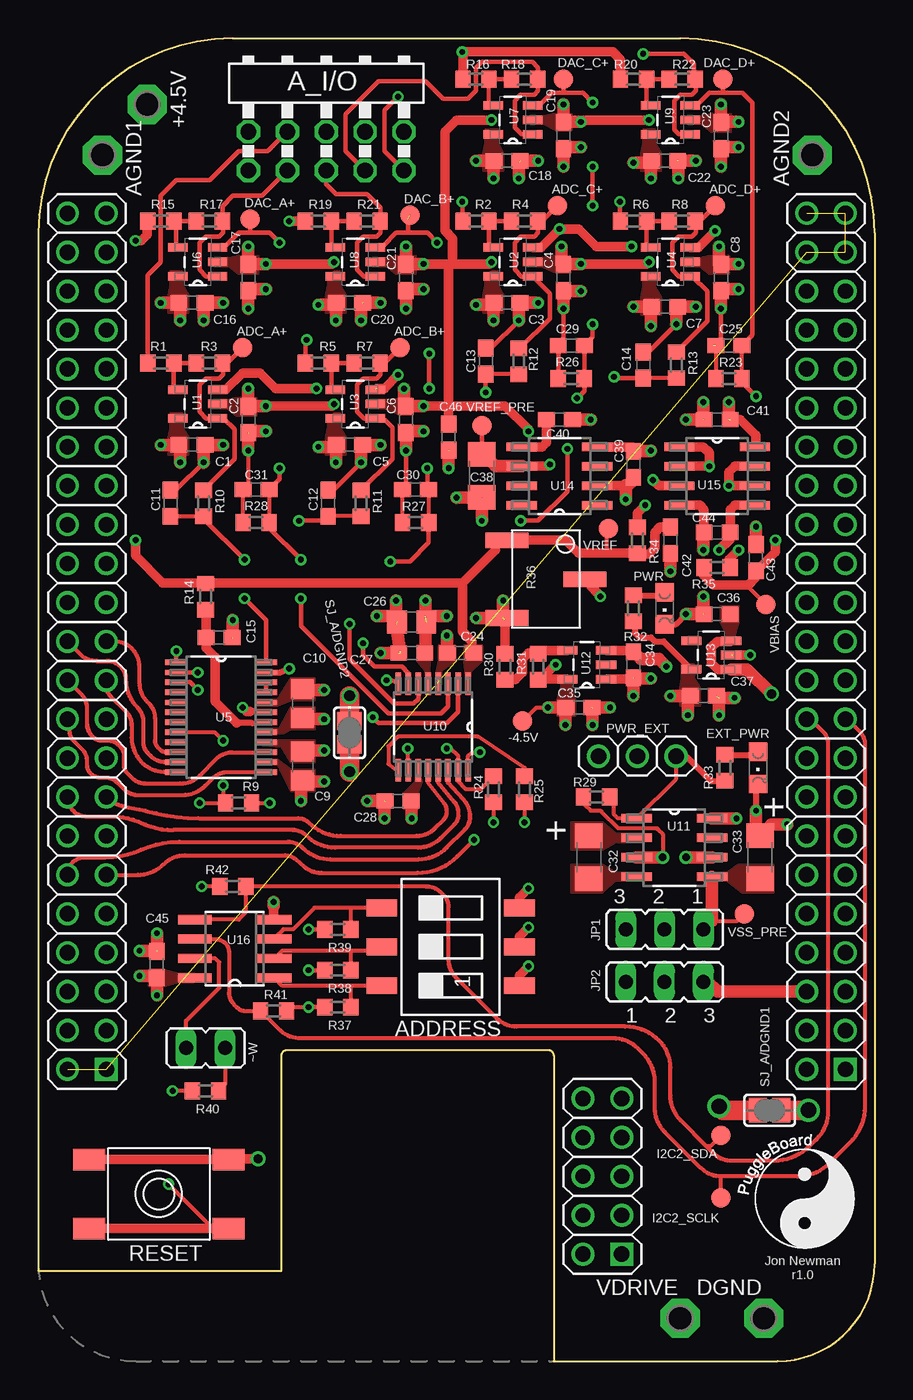
[diagram p6: board, top side]
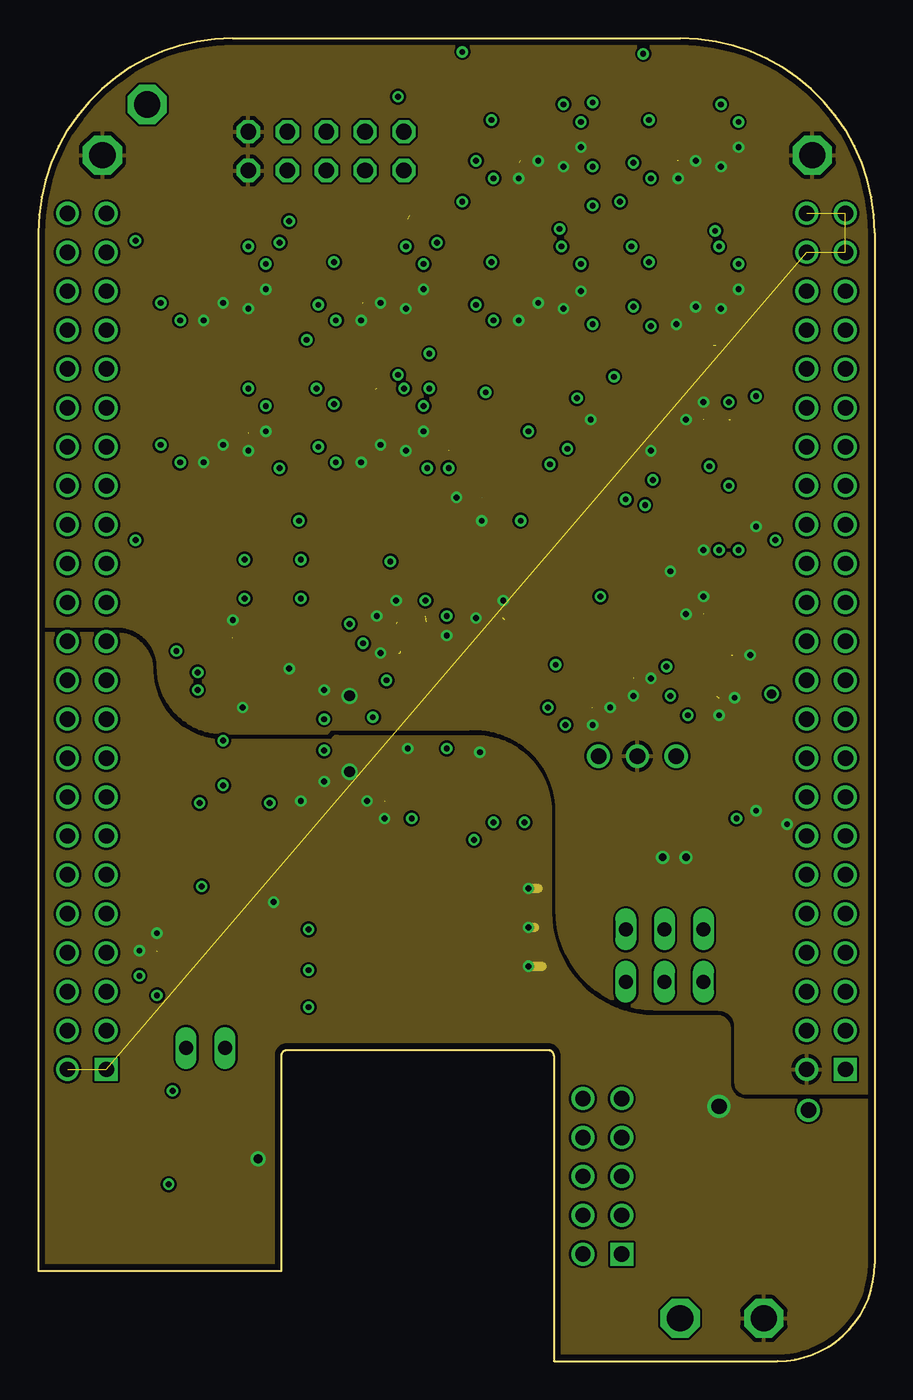
[diagram p7: board, inner layer Route2]
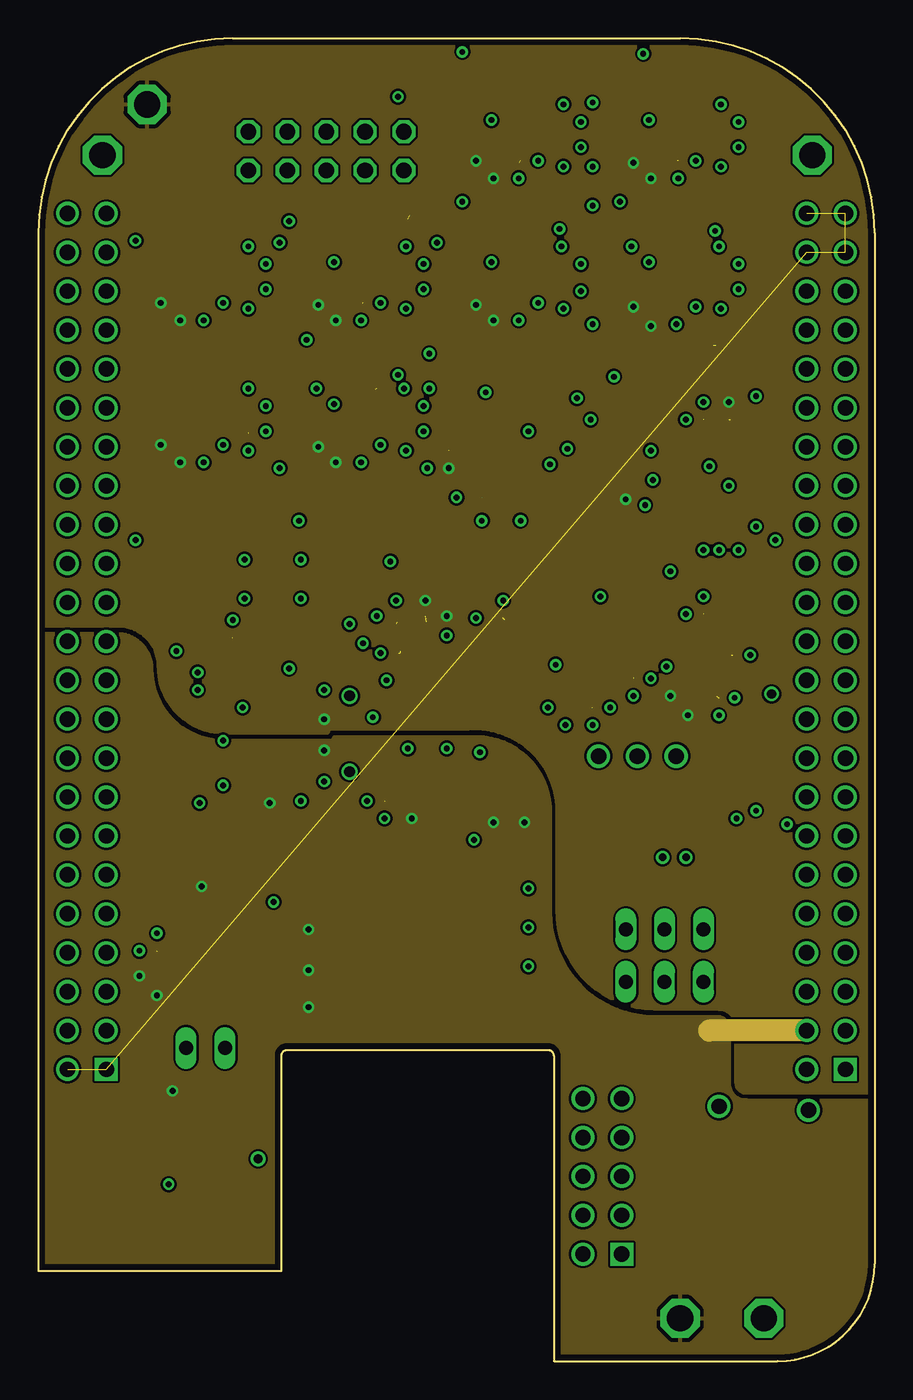
[diagram p8: board, inner layer Route15]
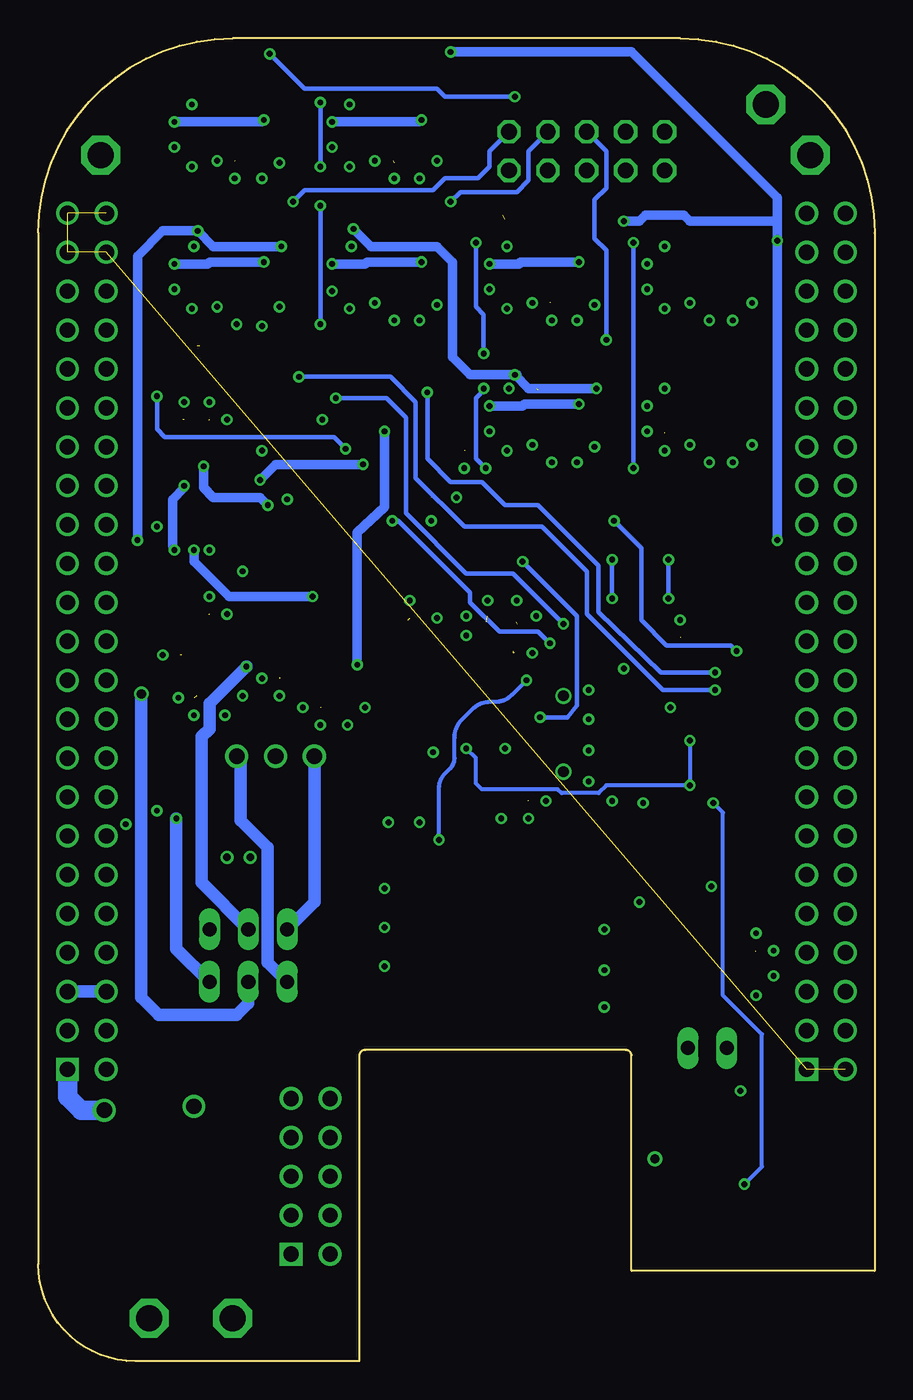
[diagram p9: board, bottom side, seen from below]

Size 54.61 x 86.36 mm. Coordinates in mm from the lower left corner, seen from the top.
Copper layers (1+2*15+16): Top 0.0356mm / dielectric 1.5011mm / Route2 0.0356mm / dielectric 0.1499mm / Route15 0.0356mm / dielectric 0.2007mm / Bottom 0.0356mm
Design rules "LaenPCBOrder *": minimum track width 6mil, minimum drill 13mil, track to track 6mil, track to pad 6mil, pad to pad 6mil, via to via 6mil, smd to smd 6mil, copper to edge 15mil, drill to drill 6mil, minimum pad ring 7mil, minimum via ring 7mil, stop-mask expansion 4mil, vias tented up to drill 0mil, thermal gap 10mil

### Footprints (pad centres in the part's own frame; a part is rotated, then mirrored left to right if it is on the bottom)
P1-17 = drill 1.702 pad 2.54 octagon: TP 0,0
B1,27 = smd 1.27 x 1.27: TP 0,0
2X05/90 = drill 1.016 octagon: 1 -5.08,-5.08; 2 -5.08,-2.54; 3 -2.54,-5.08; 4 -2.54,-2.54; 5 0,-5.08; 6 0,-2.54; 7 2.54,-5.08; 8 2.54,-2.54; 9 5.08,-5.08; 10 5.08,-2.54
SMS-003 = smd 1.092 x 2.007: 1 -2.54,-4.496; 2 0,-4.496; 3 2.54,-4.496; 4 2.54,4.496; 5 0,4.496; 6 -2.54,4.496
BEAGLEBONE_SHIELD = drill 1 square: 1 4.445,19.05; 47 52.705,19.05; 93 38.1,6.985 | drill 1: 2 1.905,19.05; 3 4.445,21.59; 4 1.905,21.59; 5 4.445,24.13; 6 1.905,24.13; 7 4.445,26.67; 8 1.905,26.67; 9 4.445,29.21; 10 1.905,29.21; 11 4.445,31.75; 12 1.905,31.75; 13 4.445,34.29; 14 1.905,34.29; 15 4.445,36.83; 16 1.905,36.83; 17 4.445,39.37; 18 1.905,39.37; 19 4.445,41.91; 20 1.905,41.91; 21 4.445,44.45; 22 1.905,44.45; 23 4.445,46.99; 24 1.905,46.99; 25 4.445,49.53; 26 1.905,49.53; 27 4.445,52.07; 28 1.905,52.07; 29 4.445,54.61; 30 1.905,54.61; 31 4.445,57.15; 32 1.905,57.15; 33 4.445,59.69; 34 1.905,59.69; 35 4.445,62.23; 36 1.905,62.23; 37 4.445,64.77; 38 1.905,64.77; 39 4.445,67.31; 40 1.905,67.31; 41 4.445,69.85; 42 1.905,69.85; 43 4.445,72.39; 44 1.905,72.39; 45 4.445,74.93; 46 1.905,74.93; 48 50.165,19.05; 49 52.705,21.59; 50 50.165,21.59; 51 52.705,24.13; 52 50.165,24.13; 53 52.705,26.67; 54 50.165,26.67; 55 52.705,29.21; 56 50.165,29.21; 57 52.705,31.75; 58 50.165,31.75; 59 52.705,34.29; 60 50.165,34.29; 61 52.705,36.83; 62 50.165,36.83; 63 52.705,39.37; 64 50.165,39.37; 65 52.705,41.91; 66 50.165,41.91; 67 52.705,44.45; 68 50.165,44.45; 69 52.705,46.99; 70 50.165,46.99; 71 52.705,49.53; 72 50.165,49.53; 73 52.705,52.07; 74 50.165,52.07; 75 52.705,54.61; 76 50.165,54.61; 77 52.705,57.15; 78 50.165,57.15; 79 52.705,59.69; 80 50.165,59.69; 81 52.705,62.23; 82 50.165,62.23; 83 52.705,64.77; 84 50.165,64.77; 85 52.705,67.31; 86 50.165,67.31; 87 52.705,69.85; 88 50.165,69.85; 89 52.705,72.39; 90 50.165,72.39; 91 52.705,74.93; 92 50.165,74.93; 94 35.56,6.985; 95 38.1,9.525; 96 35.56,9.525; 97 38.1,12.065; 98 35.56,12.065; 99 38.1,14.605; 100 35.56,14.605; 101 38.1,17.145; 102 35.56,17.145
C0603 = smd 1.1 x 1: 1 -0.85,0; 2 0.85,0
C0805 = smd 1.3 x 1.5: 1 -0.95,0; 2 0.95,0
C1206 = smd 1.6 x 1.8: 1 -1.4,0; 2 1.4,0
CHIPLED_0805 = smd 1.2 x 1.2: A 0,-1.05; C 0,1.05
JP2 = drill 0.914 long: 1 -2.54,0; 2 0,0; 3 2.54,0
1X03 = drill 1.016: 1 -2.54,0; 2 0,0; 3 2.54,0
R0603 = smd 1 x 1.1: 1 -0.85,0; 2 0.85,0
M84W-TRIMMER = smd 1.016 x 2.794: 1 -2.54,-2.54; 2 0,2.54; 3 2.54,-2.54
EVQ-Q2-A = smd 2.1 x 1.4: A -4.55,-2.25; A' 4.55,-2.25; B -4.55,2.25; B' 4.55,2.25
SJ = smd 1.168 x 1.6: 1 -0.762,0; 2 0.762,0
SOT95P280X145-5N = smd 1.27 x 0.559: 1 -1.295,0.94; 2 -1.295,0; 3 -1.295,-0.94; 4 1.295,-0.94; 5 1.295,0.94
SOP65P640X120-24N = smd 1.473 x 0.356: 1 -2.921,3.581; 2 -2.921,2.921; 3 -2.921,2.286; 4 -2.921,1.626; 5 -2.921,0.965; 6 -2.921,0.33; 7 -2.921,-0.33; 8 -2.921,-0.965; 9 -2.921,-1.626; 10 -2.921,-2.286; 11 -2.921,-2.921; 12 -2.921,-3.581; 13 2.921,-3.581; 14 2.921,-2.921; 15 2.921,-2.286; 16 2.921,-1.626; 17 2.921,-0.965; 18 2.921,-0.33; 19 2.921,0.33; 20 2.921,0.965; 21 2.921,1.626; 22 2.921,2.286; 23 2.921,2.921; 24 2.921,3.581
MO-153-AB = smd 1.473 x 0.356: 1 -2.819,2.286; 2 -2.819,1.626; 3 -2.819,0.965; 4 -2.819,0.33; 5 -2.819,-0.33; 6 -2.819,-0.965; 7 -2.819,-1.626; 8 -2.819,-2.286; 9 2.819,-2.286; 10 2.819,-1.626; 11 2.819,-0.965; 12 2.819,-0.33; 13 2.819,0.33; 14 2.819,0.965; 15 2.819,1.626; 16 2.819,2.286
SOIC127P600X175-8N = smd 1.981 x 0.559: 1 -2.464,1.905; 2 -2.464,0.635; 3 -2.464,-0.635; 4 -2.464,-1.905; 5 2.464,-1.905; 6 2.464,-0.635; 7 2.464,0.635; 8 2.464,1.905
SOT95P280X145-5N' = smd 1.321 x 0.559: 1 -1.27,0.94; 2 -1.27,0; 3 -1.27,-0.94; 4 1.27,-0.94; 5 1.27,0.94
SOT95P280X110-5N = smd 1.321 x 0.559: 1 -1.295,0.94; 2 -1.295,0; 3 -1.295,-0.94; 4 1.295,-0.94; 5 1.295,0.94
SO-08 = smd 0.6 x 2.2: 1 -1.905,-2.6; 2 -0.635,-2.6; 3 0.635,-2.6; 4 1.905,-2.6; 5 1.905,2.6; 6 0.635,2.6; 7 -0.635,2.6; 8 -1.905,2.6
JP1 = drill 0.914 long: 1 0,-1.27; 2 0,1.27

### Placement (x,y rotation side)
+4.5V  7.11,82.04 0 top
-4.5V  31.62,41.78 0 top
A_I/O  18.8,82.8 0 top
ADC_A+  13.34,66.17 0 top
ADC_B+  23.62,66.17 0 top
ADC_C+  33.91,75.44 0 top
ADC_D+  44.2,75.44 0 top
ADDRESS  26.92,27.05 90 top
AGND1  4.19,78.74 0 top
AGND2  50.55,78.74 0 top
BB1  0,0 0 top
C1  10.03,59.82 0 top
C2  13.72,61.47 270 top
C3  30.61,69.09 0 top
C4  34.29,70.74 270 top
C5  20.32,59.82 0 top
C6  24,61.47 270 top
C7  40.89,68.83 0 top
C8  44.58,70.74 270 top
C9  17.27,38.86 270 top
C10  17.27,42.93 270 top
C11  8.64,56.01 270 top
C12  18.92,56.01 270 top
C13  29.21,65.28 270 top
C14  39.5,65.02 270 top
C15  11.81,47.24 180 top
C16  10.03,69.09 0 top
C17  13.72,70.74 270 top
C18  30.61,78.36 0 top
C19  34.29,80.01 270 top
C20  20.32,69.09 0 top
C21  24,70.74 270 top
C22  40.89,78.36 0 top
C23  44.58,80.01 270 top
C24  27.56,46.23 180 top
C25  45.09,66.29 180 top
C26  24.38,48.26 180 top
C27  24.38,46.23 180 top
C28  23.5,36.58 180 top
C29  34.8,66.29 180 top
C30  24.64,56.9 180 top
C31  14.22,56.9 180 top
C32  35.94,32.89 270 top
C33  47.12,32.89 270 top
C34  38.86,45.47 270 top
C35  35.31,42.67 0 top
C36  44.32,48.77 180 top
C37  43.43,43.43 0 top
C38  28.96,57.78 270 top
C39  38.86,58.55 270 top
C40  34.04,61.47 180 top
C41  44.32,61.47 180 top
C42  41.27,53.59 270 top
C43  46.86,52.45 90 top
C44  44.32,54.1 180 top
C45  7.75,25.91 90 top
C46  26.8,60.33 90 top
DAC_A+  13.84,74.55 0 top
DAC_B+  24.26,74.8 0 top
DAC_C+  34.29,83.69 0 top
DAC_D+  44.7,83.69 0 top
DGND  47.37,2.79 0 top
EXT_PWR  46.99,38.73 180 top
I2C2_SCLK  44.58,10.67 0 top
I2C2_SDA  44.58,14.73 0 top
JP1  40.89,28.19 180 top
JP2  40.89,24.77 0 top
PWR  40.89,49.15 180 top
PWR_EXT  39.12,39.5 180 top
R1  8,65.15 180 top
R2  28.57,74.42 180 top
R3  11.18,65.15 180 top
R4  31.75,74.42 180 top
R5  18.29,65.15 180 top
R6  38.86,74.42 180 top
R7  21.46,65.15 180 top
R8  42.04,74.42 180 top
R9  13.08,36.45 0 top
R10  10.79,56.01 90 top
R11  21.08,56.01 90 top
R12  31.37,65.28 90 top
R13  41.66,65.02 90 top
R14  10.92,49.91 90 top
R15  8,74.42 180 top
R16  28.57,83.69 180 top
R17  11.18,74.42 180 top
R18  31.75,83.69 180 top
R19  18.29,74.42 180 top
R20  38.86,83.69 180 top
R21  21.46,74.42 180 top
R22  42.04,83.69 180 top
R23  45.09,64.14 0 top
R24  29.72,37.34 270 top
R25  31.75,37.34 270 top
R26  34.8,64.14 0 top
R27  24.64,54.74 0 top
R28  14.22,54.74 0 top
R29  36.45,36.83 180 top
R30  30.48,45.34 90 top
R31  32.64,45.34 270 top
R32  38.86,49.15 270 top
R33  44.83,38.73 270 top
R34  39.12,53.59 90 top
R35  44.32,51.82 0 top
R36  33.15,51.05 270 top
R37  19.56,23.11 180 top
R38  19.56,25.53 180 top
R39  19.56,28.19 180 top
R40  10.92,17.65 180 top
R41  15.37,22.86 0 top
R42  12.7,30.99 180 top
RESET  7.87,10.92 0 top
SJ_A/DGND1  47.75,16.38 180 top
SJ_A/DGND2  20.32,41.02 270 top
U1  10.41,62.48 180 top
U2  30.99,71.75 180 top
U3  20.7,62.48 180 top
U4  41.27,71.75 180 top
U5  11.94,42.04 0 top
U6  10.41,71.75 180 top
U7  30.99,81.03 180 top
U8  20.7,71.75 180 top
U9  41.27,81.03 180 top
U10  25.78,41.4 270 top
U11  41.53,33.53 0 top
U12  MAX1735  [SOT95P280X145-5N']  35.81,45.47 180 top
U13  43.94,46.1 180 top
U14  34.04,57.78 180 top
U15  44.32,57.78 0 top
U16  12.83,26.92 90 top
VBIAS  47.5,49.4 0 top
VDRIVE  41.91,2.79 0 top
VREF  37.21,54.36 0 top
VREF_PRE  28.96,61.09 0 top
VSS_PRE  46.1,29.21 0 top
~W  10.92,20.45 90 top

### Tracks (layer width: path | path; a pad name or v marks a point on that pad's centre or on a via)
+4.5V  (via drill 0.38)  (3 unrouted)
  Top 0.406: R32.2 38.95,48.3 38.95,47.54 39.24,47.24 40.01,47.24 40.26,46.99 40.82,46.99 U13.5
  Top 0.61: U14.2 38.61,57.15 38.86,57.4 C39.2 38.35,57.19 | C41.1 45.85,61.47 46.86,60.45 46.86,59.77 U15.8
  Top 0.813: C16.1 9.27,69 v9.27,67.94 9.27,68.96 9.14,69.09 v8,69.09 | v19.43,67.94 19.43,68.96 v18.29,68.96 | v28.57,78.36 29.72,78.36 | v29.72,77.22 29.72,78.23 | v38.86,78.23 40.01,78.23 v40.01,77.22 | 19.56,59.73 C5.1 | 19.56,59.69 19.43,59.82 | v19.43,58.67 19.43,59.69 v18.29,59.69 | 29.84,69 C3.1 | 29.84,68.96 29.72,69.09 | v29.72,67.94 29.72,68.96 v28.57,68.96 | 40.13,68.87 40.04,68.96 | 40.13,68.83 40.01,68.96 | v40.01,67.56 40.01,68.83 v38.86,68.83 | C1.1 9.27,59.73 v9.27,58.67 9.27,59.69 9.14,59.82 v8,59.82 | v42.42,42.16 42.42,43.43 v41.27,43.43 | 25.27,46.48 25.27,48.64 | 25.27,48.64 v25.27,49.66 | 25.27,48.64 v26.67,48.64 | v18.67,41.91 17.27,41.91 | v45.09,62.61 45.09,61.47 | 38.35,57.19 v38.35,56.26 | v26.8,58.29 26.8,59.44
  pour Top (no thermals): 29.97,80.39 29.97,79.5 30.35,78.87 30.35,77.72 29.08,77.72 29.08,78.87 29.21,79.5 29.21,80.39
  pour Top (no thermals): 40.26,80.39 40.26,79.5 40.64,78.87 40.64,77.72 39.37,77.72 39.37,78.87 39.5,79.5 39.5,80.39
  pour Top (no thermals): 19.68,71.12 19.68,70.23 20.07,69.6 20.07,68.45 18.8,68.45 18.8,69.6 18.92,70.23 18.92,71.12
  pour Top (no thermals): 9.4,71.12 9.4,70.23 9.78,69.6 9.78,68.45 8.51,68.45 8.51,69.6 8.64,70.23 8.64,71.12
  pour Top (no thermals): 19.68,61.85 19.68,60.96 20.07,60.33 20.07,59.18 18.8,59.18 18.8,60.33 18.92,60.96 18.92,61.85
  pour Top (no thermals): 29.97,71.12 29.97,70.23 30.35,69.6 30.35,68.45 29.08,68.45 29.08,69.6 29.21,70.23 29.21,71.12
  pour Top (no thermals): 40.26,70.99 40.26,70.1 40.64,69.47 40.64,68.33 39.37,68.33 39.37,69.47 39.5,70.1 39.5,70.99
  pour Top (no thermals): 9.4,61.85 9.4,60.96 9.78,60.33 9.78,59.18 8.51,59.18 8.51,60.33 8.64,60.96 8.64,61.85
  pour Top (no thermals): 42.8,45.47 42.8,44.58 43.18,43.94 43.18,42.8 41.91,42.8 41.91,43.94 42.04,44.58 42.04,45.47
  pour Route15: 0,73.66 arc-90 12.7,86.36 41.91,86.36 arc-90 54.61,73.66 54.61,17.53 46.23,17.53 arc-90 45.59,18.16 45.59,21.84 arc90 44.45,22.99 40.26,22.99 arc-90 33.91,29.46 33.91,36.32 arc90 28.07,41.27 19.05,41.27 arc90 18.92,41.15 arc-90 18.8,41.02 12.06,41.02 arc-90 7.87,45.47 arc90 5.08,48.01 0,48.01
  pour Top (no thermals): 25.53,43.94 25.53,45.09 25.65,46.74 24.77,46.74 24.77,45.72 25.27,45.09 25.4,43.94
  pour Top (no thermals): 14.22,41.02 16,41.02 16.51,41.27 18.03,41.27 18.03,42.67 16.51,42.67 15.75,41.27 14.22,41.27
-4.5V  (via drill 0.38)
  Top 0.254: -4.5V.TP 32.51,42.67 v33.27,42.67
  Top 0.61: U12.5 32.73,44.53 | 32.73,44.53 arc45 R31.2 | 32.73,44.53 32.89,44.56 v33.78,45.47 | v32,60.71 32,60.83 30.48,62.36 26.92,62.36 | 26.92,62.36 26.8,62.36 | 26.8,62.36 v25.15,62.36 | v14.86,62.36 19.18,62.36 v19.3,62.48 | 26.8,71.63 26.8,62.36 | 26.8,71.63 27.18,71.63 | 27.18,71.63 29.46,71.63 v29.59,71.75 | v25.15,71.63 26.8,71.63 | C46.2 26.8,62.23 26.92,62.36 | v14.86,71.63 19.18,71.63 v19.3,71.75 | v35.43,71.63 39.75,71.63 v39.88,71.75 | v35.43,80.9 35.56,81.03 v39.88,81.03 | v29.59,81.03 27.3,81.03 26.54,80.26 26.54,73.79 27.05,73.28 27.05,71.75 27.18,71.63
  Top 0.813: v13.72,72.77 13.72,71.75 | v14.86,71.63 13.72,71.63 | v24,72.77 24,71.75 | v25.15,71.63 24,71.63 | v34.29,82.04 34.29,81.03 | v35.43,80.9 34.29,80.9 | v44.58,82.04 44.58,81.03 | v45.72,80.9 44.58,80.9 | v13.72,63.5 13.72,62.36 v14.86,62.36 | v23.88,63.5 23.88,62.48 | v25.15,62.36 23.88,62.36 | v34.16,72.77 34.16,71.75 | v35.43,71.63 34.16,71.63 | v44.45,72.77 44.45,71.63 v45.72,71.63 | v33.27,42.67 34.42,42.67 v34.42,41.53
  Bottom 0.61: v33.78,45.47 33.78,54.1 32,55.75 v32,60.71 | v19.3,62.48 22.86,62.48 22.99,62.36 v25.15,62.36 | v29.59,71.75 33.15,71.75 33.27,71.63 v35.43,71.63 | v19.3,71.75 23.11,71.75 23.24,71.63 v25.15,71.63 | v39.88,71.75 43.43,71.75 43.56,71.63 v45.72,71.63 | v29.59,81.03 29.72,80.9 v35.43,80.9 | v39.88,81.03 40.01,80.9 v45.72,80.9
  pour Top (no thermals): 11.56,72.01 12.45,72.01 13.08,72.14 14.35,72.14 14.35,70.99 13.08,70.99 12.45,71.5 11.56,71.5
  pour Top (no thermals): 32.13,81.28 33.02,81.28 33.66,81.41 34.8,81.41 34.8,80.39 33.78,80.39 33.02,80.77 32.13,80.77
  pour Top (no thermals): 42.42,81.28 43.31,81.28 43.94,81.41 45.21,81.41 45.21,80.26 43.94,80.26 43.31,80.77 42.42,80.77
  pour Top (no thermals): 21.84,72.01 22.86,72.01 23.37,72.14 24.64,72.14 24.64,70.99 23.37,70.99 22.73,71.5 21.84,71.5
  pour Top (no thermals): 42.42,81.28 43.31,81.28 43.94,81.41 45.21,81.41 45.21,80.26 43.94,80.26 43.31,80.77 42.42,80.77
  pour Top (no thermals): 11.43,62.74 12.32,62.74 12.95,62.87 14.22,62.87 14.22,61.72 12.95,61.72 12.32,62.23 11.43,62.23
  pour Top (no thermals): 21.72,62.74 22.48,62.74 24.38,62.87 24.38,61.85 23.5,61.85 22.61,62.23 21.72,62.23
  pour Top (no thermals): 32,72.01 32.89,72.01 33.66,72.14 34.67,72.14 34.67,71.12 33.66,71.12 32.89,71.5 32,71.5
  pour Top (no thermals): 42.29,72.01 43.18,72.01 43.81,72.14 45.09,72.14 45.09,70.99 43.81,70.99 43.18,71.5 42.29,71.5
  pour Top (no thermals): 34.16,44.58 34.16,43.94 33.91,43.18 33.91,42.16 35.05,42.16 35.05,43.18 34.8,43.94 34.8,44.58
ADC_A
  Top 0.305: R1.2 7.15,70.91 8,71.75 8,76.07 9.02,77.09 11.18,77.09 13.08,78.99 14.99,78.99 A_I/O.4
ADC_A+
  Top 0.254: 12.12,61.54 U1.1
  Top 0.305: U1.1 10.97,61.54 10.54,61.98 10.54,63.75 10.92,64.14 11.81,64.14 12.06,64.39 12.06,65.11 R3.1 12.32,65.15 ADC_A+.TP | R10.2 12.83,58.89 12.83,60.83 12.12,61.54
ADC_B  (via drill 0.38)
  Top 0.305: R5.2 17.44,66.59 v17.53,66.67
  Bottom 0.305: v17.53,66.67 17.53,72.52 18.29,73.28 18.29,75.82 17.53,76.58 17.53,78.99 A_I/O.6
ADC_B+
  Top 0.254: 22.61,61.47 22.07,61.47 U3.1
  Top 0.305: U3.1 21.26,61.54 20.83,61.98 20.83,63.75 21.21,64.14 22.1,64.14 22.35,64.39 22.35,65.11 R7.1 22.61,65.15 ADC_B+.TP | R11.2 23.11,58.89 23.11,60.96 22.61,61.47
ADC_C  (via drill 0.38)
  Top 0.305: v27.69,75.69 27.69,74.46 R2.2
  Bottom 0.305: A_I/O.8 22.61,78.99 22.61,77.09 23.37,76.33 27.05,76.33 v27.69,75.69
ADC_C+
  Top 0.254: R12.2 31.46,66.13
  Top 0.305: 31.46,66.13 33.4,68.07 33.4,69.7 U2.1 31.55,70.81 31.11,71.25 31.11,73.03 31.5,73.41 32.38,73.41 32.64,73.66 32.64,74.38 R4.1 32.89,74.42 ADC_C+.TP
ADC_D  (via drill 0.38)
  Top 0.305: v37.97,75.69 37.97,74.46 R6.2
  Bottom 0.305: A_I/O.10 25.15,78.99 25.15,77.98 25.91,77.22 28.07,77.22 28.83,76.45 37.21,76.45 v37.97,75.69
ADC_D+
  Top 0.254: 42.72,70.81 U4.1
  Top 0.305: U4.1 41.83,70.81 41.4,71.25 41.4,73.03 41.78,73.41 42.67,73.41 42.93,73.66 42.93,74.38 R8.1 43.18,74.42 ADC_D+.TP | R13.2 43.69,67.91 43.69,69.85 42.72,70.81
ADC_SPI0
  Top 0.254: U5.10 8.41,39.75 arc-45 7.93,39.95 7.81,40.07 arc-45 7.62,40.52 7.62,41.97 arc45 7.21,42.95 7.09,43.08 arc-45 6.6,44.25 6.6,45.34 arc90 4.95,46.99 BB1.23
ADC_SPI1
  Top 0.254: BB1.24 2.73,46.17 arc45 3.81,45.72 4.49,45.72 arc-90 5.71,44.49 arc45 6.46,42.69 arc-45 6.86,41.73 6.86,40.37 arc45 7.12,39.74 7.34,39.52 arc45 8.32,39.12 U5.11
ADC_SPI2
  Top 0.254: BB1.21 4.45,44.06 arc45 4.71,43.43 5.72,42.41 arc-45 6.1,41.51 6.1,40.69 arc45 6.83,39.01 arc45 8.37,38.48 8.99,38.48 U5.12
ADC_SPI3
  Top 0.254: BB1.20 2.03,41.78 2.03,41.15 arc45 2.3,40.5 2.88,39.92 arc-45 3.17,39.2 3.17,38.91 arc45 3.39,38.39 arc45 4.09,38.1 4.42,38.1 arc-45 5.12,37.81 5.55,37.37 arc45 6.56,36.96 9.44,36.96 arc45 10.88,37.55 11.37,38.04 arc-45 12.37,38.46 U5.13
ADC_SPI4
  Top 0.254: BB1.22 2.77,43.59 arc-45 3.17,42.6 3.17,41.63 arc45 3.52,40.8 3.58,40.74 arc45 4.13,40.51 4.58,40.51 arc-45 5.21,40.25 5.37,40.1 arc-45 5.59,39.56 5.59,38.88 arc45 5.78,38.42 6.11,38.09 arc45 7,37.72 9.29,37.72 arc45 10.55,38.24 11.64,39.33 arc-45 12.66,39.75 U5.15
AGND  (via drill 0.38, 0.5, 0.7)  (17 unrouted)
  Top 0.254: R29.2 35.6,36.52 arc45 35.67,36.34 36.07,35.94 36.6,35.94 arc-45 36.78,35.87 37.85,34.8 40.28,34.8 arc-45 40.46,34.72 40.77,34.42 40.77,33.12 arc-45 40.69,32.95 v40.77,32.89 | R27.1 C30.2 24,57.11 | C25.2 R23.1 | C29.2 33.95,66.46 | R28.1 C31.2 13.72,57.24 v13.72,59.44 | 29.25,66.17 C13.1 29.55,66.13 | 39.84,65.87 C14.1 | 8.98,56.86 C11.1 | 19.27,56.86 C12.1
  Top 0.305: 34.29,79.25 C19.2 34.29,79.12 | 44.58,79.12 C23.2 44.66,79.25 44.7,79.25 | 24,69.85 C21.2 24.09,69.98 24.13,69.98 | 13.84,69.98 13.8,69.98 C17.2 13.72,69.85 | 10.79,69.09 C16.2 10.92,69.09 | 13.72,60.58 13.68,60.58 13.59,60.49 13.59,60.45 | 24,60.71 23.96,60.71 C6.2 23.88,60.58 | 34.29,69.85 34.25,69.98 C4.2 34.16,69.85 | 44.58,69.98 44.54,69.98 C8.2 44.45,69.85 | 10.79,59.82 C1.2 10.92,59.82 | 21.08,59.82 C5.2 21.21,59.82 | 31.37,69.09 C3.2 31.5,69.09 | 41.66,68.83 C7.2 41.78,68.83 | C29.2 R26.1 | 33.95,66.46 34.29,66.8 v34.29,68.71 | v44.58,68.71 44.58,66.8 44.07,66.29 | v24,59.44 24,57.11 | v41.66,67.69 39.84,65.87 | v31.37,67.94 29.55,66.13 | v10.79,58.67 8.98,56.86 | v21.08,58.67 19.27,56.86 | U5.19 14.81,42.42 14.1,42.42
  Top 0.406: PWR.C 41.62,48.1 v42.29,48.77 | U5.23 15.75,44.96 v16.38,45.21 | EXT_PWR.C 46.86,37.56 v46.86,35.94 | 14.1,42.42 13.84,42.42
  Top 0.61: v46.48,46.1 45.34,46.1 | U12.1 38.77,44.53 C34.2 | C39.1 38.86,59.44 38.73,59.56 38.86,59.69 U14.4 | C44.2 43.47,55.59 43.18,55.88 U15.4 | R30.2 30.48,48.39 R36.3 | 13.84,42.42 13.59,42.42 v13.34,42.67
  Top 0.813: U11.6 v42.29,32.89 | v40.77,32.89 U11.3 | 10.79,69.09 v10.79,67.94 | v12.06,69.09 10.92,69.09 | v21.08,67.94 21.08,69.09 | v22.35,69.09 21.21,69.09 | v13.72,68.71 13.72,69.85 | v14.86,69.98 13.84,69.98 | v24,68.71 24,69.85 | v25.15,69.98 24.13,69.98 | v32.64,78.36 31.62,78.36 | v34.29,77.98 34.29,79.12 | v35.43,79.25 34.29,79.25 | v31.37,77.22 31.37,78.23 | v44.58,77.98 44.58,79.12 | v45.72,79.25 44.7,79.25 | v41.78,77.22 41.78,78.36 v42.93,78.36 | v13.72,59.44 13.72,60.58 | v14.86,60.71 13.72,60.71 | v45.72,69.98 44.58,69.98 v44.58,68.71 | v34.29,68.71 34.29,69.85 v35.43,69.85 | v24,59.44 24,60.71 v25.15,60.71 | 10.79,59.82 v10.79,58.67 | v12.06,59.82 10.92,59.82 | 21.08,59.82 v21.08,58.67 | v22.35,59.82 21.21,59.82 | 31.37,69.09 v31.37,67.94 | v32.64,69.09 31.5,69.09 | 41.66,68.83 v41.66,67.69 | v42.93,68.83 41.78,68.83 | v42.29,48.77 43.43,48.77 v43.43,49.91 | v44.45,42.16 44.45,43.31 v45.47,43.31 | v37.34,42.67 36.2,42.67 v36.2,41.53 | v40.01,44.58 38.86,44.58 v38.86,43.43 | v22.1,48.64 23.37,48.64 v23.37,49.66 | C24.2 26.67,46.35 v26.67,47.37 | 46.86,34.29 v46.86,35.94 | 23.62,46.35 23.37,48.13 | 17.27,43.81 v18.67,43.81 | v12.7,48.39 12.7,47.24 | v42.29,61.47 43.43,61.47 v43.43,62.61 | v41.27,51.56 C42.2 | v43.43,52.96 43.43,54.06 C44.2 | v46.86,54.48 C43.2 | v28.96,54.86 C38.2 v27.3,56.39 | v40.01,59.44 39.97,59.4 C39.1 | C40.1 v36.07,61.47 | v28.57,48.51 29.72,48.51 | v30.35,49.66 30.35,48.51 | v22.35,46.23 23.62,46.23 | v48.9,35.05 47.88,35.05 C33.1
  Top 1.27: SJ_A/DGND2.1 v20.32,43.43
  pour Route2: 0,73.66 arc-90 12.7,86.36 41.91,86.36 arc-90 54.61,73.66 54.61,17.53 46.23,17.53 arc-90 45.59,18.16 45.59,21.84 arc90 44.44,22.99 40.26,22.99 arc-90 33.91,29.46 33.91,36.32 arc90 28.07,41.27 19.18,41.27 arc90 18.92,41.15 arc-90 18.67,41.02 12.06,41.02 arc-90 7.87,45.34 arc90 5.08,48.01 0.25,48.01
  pour Top (no thermals): 14.22,43.18 14.22,42.8 15.62,42.8 16.51,43.18 18.03,43.18 18.03,44.58 16.51,44.58 15.62,43.18
  pour Top (no thermals): 26.04,44.2 26.04,45.09 26.16,45.72 26.16,46.74 27.18,46.74 27.18,45.72 26.29,45.09 26.29,44.2
DAC_A
  Top 0.305: U6.1 10.97,70.81 10.54,71.25 10.54,73.03 10.92,73.41 11.81,73.41 12.06,73.66 12.06,74.38 R17.1 12.03,75.4 12.7,76.07 14.61,76.07 A_I/O.3
DAC_A+  (via drill 0.38)
  Top 0.254: C31.1 R28.2 | 12.12,72.69 U6.3
  Top 0.305: 13.97,73.66 13.08,73.66 12.24,72.82 11.84,72.82 U6.3 | 13.97,73.66 15.11,73.66 v15.75,73.03 | DAC_A+.TP 13.84,73.79 13.97,73.66 | v15.75,58.29 15.75,57.57 C31.1 | U10.3 26.75,42.75 26.29,42.29 22.86,42.29 17.14,48.01 v17.14,49.78 | v17.14,52.32 15.07,54.4 R28.2
  Bottom 0.305: v15.75,73.03 v15.75,58.29 | v17.14,49.78 v17.14,52.32
DAC_B
  Top 0.305: U8.1 21.26,70.81 20.83,71.25 20.83,73.03 21.21,73.41 22.1,73.41 22.35,73.66 22.35,74.38 R21.1 22.35,74.46 22.35,75.31 21.46,76.2 19.43,76.2 18.8,76.83 A_I/O.5
DAC_B+  (via drill 0.38)  (1 unrouted)
  Top 0.254: C30.1 R27.2
  Top 0.305: 24.26,73.66 23.37,73.66 22.53,72.82 22.12,72.82 U8.3 | 24.26,73.66 25.4,73.66 v26.04,73.03 | 24.13,74.55 24.13,73.79 24.26,73.66 | v25.53,65.79 v25.53,63.5 | v25.4,58.29 25.4,56.98 C30.1 | R27.2 25.49,53.43 24.26,52.2 v22.99,52.2 | U10.2 27.41,42.39 26.67,41.66 22.23,41.66 v21.84,42.04
  Bottom 0.305: v26.04,73.03 26.04,68.83 25.53,68.33 v25.53,65.79 | v25.53,63.5 25.53,63.37 26.04,62.87 26.04,58.93 v25.4,58.29 | v21.84,42.04 20.07,42.04 19.43,42.8 19.43,48.64 v22.99,52.2
DAC_C
  Top 0.305: U7.1 31.55,80.09 31.11,80.52 31.11,82.3 31.5,82.68 32.38,82.68 32.64,82.93 32.64,83.53 R18.1 32.64,83.73 32.64,84.45 32.26,84.84 28.96,84.84 28.57,84.45 28.57,82.93 28.07,82.42 26.42,82.42 25.27,83.57 22.23,83.57 20.07,81.41 20.07,78.99 A_I/O.7
DAC_C+  (via drill 0.38)
  Top 0.305: U7.3 32.69,81.97 33.53,82.8 34.42,82.8 | 34.42,82.8 35.56,82.8 v36.2,82.17 | DAC_C+.TP 34.29,82.93 34.42,82.8 | v36.2,77.98 v36.2,75.44 | v36.2,67.69 36.2,66.84 C29.1 R26.2 35.65,63.33 v35.18,62.87 | U10.6 24.82,43.23 24.51,42.93 23.24,42.93 20.32,45.85 v20.32,48.13
  Bottom 0.305: v36.2,82.17 v36.2,77.98 | v36.2,75.44 v36.2,67.69 | v35.18,62.87 31.88,62.87 30.61,61.59 30.61,55.37 26.67,51.44 23.62,51.44 v20.32,48.13
DAC_D  (via drill 0.38)
  Top 0.305: U9.1 41.83,80.09 41.53,80.39 41.53,82.3 41.91,82.68 42.67,82.68 42.93,82.93 42.93,83.65 R22.1 42.8,83.78 42.8,84.71 42.16,85.34 v39.5,85.34 | A_I/O.9 22.61,78.99 22.61,81.66 v23.5,82.55
  Bottom 0.305: v39.5,85.34 37.21,83.06 28.57,83.06 28.07,82.55 v23.5,82.55
DAC_D+  (via drill 0.38)
  Top 0.254: R23.2 C25.1
  Top 0.305: U9.3 42.98,81.97 43.81,82.8 44.83,82.8 | 44.83,82.8 45.97,82.8 46.61,82.17 46.61,66.97 C25.1 | DAC_D+.TP 44.7,82.93 44.83,82.8 | R23.2 45.94,63.92 v46.86,62.99 | v34.54,59.56 34.54,56.77 32.64,54.86 v31.5,54.86 | U10.7 24.16,44.93 23.75,45.34 21.97,45.34 21.21,46.1 v21.21,46.86
  Bottom 0.305: v46.86,62.99 46.86,60.83 46.35,60.33 35.31,60.33 v34.54,59.56 | v31.5,54.86 31.11,54.86 26.42,50.16 26.42,49.53 24.51,47.62 21.97,47.62 v21.21,46.86
DAC_LDAC
  Top 0.254: R25.1 31.75,38.73 28.7,40.77 23.5,40.77 22.86,40.13 22.86,38.99 23.39,38.58 U10.9
DAC_SPI0
  Top 0.254: U10.12 25.45,37.8 26.51,36.4 arc-37 26.67,35.93 26.67,35.83 arc-45 26.48,35.37 25.88,34.77 arc-45 24.72,34.29 19.74,34.29 arc-45 17.7,35.13 arc45 16.98,35.43 10.46,35.43 arc-14 7.7,35.77 7.01,35.94 arc2 6.96,35.95 5.55,36.23 arc-27 4.71,36.62 BB1.15
DAC_SPI1
  Top 0.254: BB1.16 arc90 3.17,35.56 4.83,35.56 arc-22 6.53,35.22 7.02,35.02 arc22 8.8,34.67 16.62,34.67 arc-45 17.52,34.3 arc45 19.38,33.53 24.81,33.53 arc45 26.25,34.13 27.17,35.05 arc45 27.43,35.67 27.43,35.81 arc40 27.19,36.49 26.11,37.77 U10.13 26.16,38.53
DAC_SPI2
  Top 0.254: BB1.12 arc-90 3.05,32.89 4.41,32.89 arc24 6.69,33.38 arc-24 9.2,33.91 16.3,33.91 arc-45 17.28,33.5 arc45 19.06,32.77 24.84,32.77 arc45 26.67,33.52 27.86,34.72 arc45 28.19,35.52 28.19,35.57 arc43 27.77,36.66 26.75,37.77 U10.14
DAC_SPI3  (via drill 0.38)
  Top 0.254: BB1.11 6.49,31.75 arc45 8.2,32.46 arc-45 9.56,33.02 16.12,33.02 arc-41 16.83,32.76 17.34,32.3 arc41 18.48,31.88 24.76,31.88 arc45 27.37,32.96 v28.45,34.04 | v22.73,44.45 22.94,44.45 arc-45 U10.8
  Bottom 0.254: v28.45,34.04 28.45,37.39 arc45 28.04,38.38 27.7,38.73 arc-45 27.43,39.36 27.43,40.72 arc45 26.95,41.89 26.27,42.57 arc45 25.09,43.05 24.76,43.05 arc-45 23.68,43.5 v22.73,44.45
DGND  (via drill 0.38, 0.6, 0.7, 1)  (2 unrouted)
  Top 0.254: U10.10 24.13,38.61 v24.13,40.01 | U10.16 28.07,39.5 28.32,39.75 v28.83,39.75
  Top 0.406: U16.4 15.43,29.15 15.37,29.21
  Top 0.61: 15.37,29.21 15.37,29.72 | v14.35,13.21 12.46,13.21 RESET.B' RESET.B | ADDRESS.2 31.42,27.74 v32,28.32 | ADDRESS.3 31.42,30.28 v32,30.86 | ADDRESS.1 31.42,25.2 v32,25.78
  Top 0.813: v21.46,36.58 22.61,36.58 v22.61,35.43 | v18.67,37.85 17.27,37.85 | v17.14,36.58 17.14,37.85 | v6.6,26.8 7.62,26.8 | v7.75,27.94 7.75,26.8 | 15.37,29.72 v15.37,29.97
  Top 1.27: SJ_A/DGND2.2 v20.32,38.48 | SJ_A/DGND1.2 44.7,16.38 v44.45,16.64
  Route2 0.61: v32,28.32 32.38,28.32 | v32,30.86 32.64,30.86 | v32,25.78 32.89,25.78
  Route2 1.27: v44.45,16.64 44.32,16.64
  pour Route2: 0,5.89 0.25,47.5 5.08,47.5 arc-90 7.37,45.08 arc90 12.06,40.51 18.8,40.51 19.05,40.51 arc90 19.3,40.64 arc-90 19.56,40.77 28.19,40.76 arc-90 33.4,36.19 33.4,29.34 arc90 40.26,22.48 44.32,22.48 arc-90 45.09,21.72 45.09,18.16 arc90 46.23,17.02 54.61,17.02 54.69,6.54 arc-90 48.2,0 33.66,0 33.66,20.32 15.88,20.32 15.88,5.89
  pour Top (no thermals): 14.22,38.99 15.62,38.99 16.51,37.21 18.03,37.21 18.03,38.61 16.51,38.61 15.62,39.24 14.22,39.24
GND  (5 unrouted)
I2C2_SCL
  Top 0.254: BB1.65 arc-45 52.92,41.82 53.6,41.14 arc-45 53.98,40.24 53.98,16.67 arc-45 52.96,14.23 51.66,12.92 arc-45 49.59,12.06 44.58,12.06 | U16.6 11.54,27.56 arc-45 12.22,27.27 arc-45 12.45,26.73 12.45,24.07 arc45 12.76,23.31 12.98,23.09 arc45 13.53,22.86 R41.1 15.71,21.67 arc45 17.12,21.08 37.53,21.08 arc-45 39.15,20.41 39.51,20.05 arc-45 40.26,18.25 40.26,16.52 arc45 40.89,14.99 43.28,12.6 arc45 44.58,12.06 | I2C2_SCLK.TP 44.58,12.06
I2C2_SDA
  Top 0.254: U16.5 13.08,28.83 13.55,29.3 R42.1 25.33,30.99 arc-45 26.32,30.58 26.49,30.41 arc-45 26.8,29.66 26.8,26.2 arc45 27.27,25.05 29.95,22.38 arc45 31.23,21.84 38.33,21.84 arc-45 40.54,20.93 arc-45 41.27,19.16 41.27,17.33 arc45 41.95,15.71 43.62,14.03 | BB1.66 50.2,41.91 arc-45 50.58,41.75 51.26,41.06 arc-45 51.56,40.35 51.56,16.31 arc-45 50.8,14.48 50.37,14.05 arc-45 48.03,13.08 45.27,13.08 arc-45 44.09,13.57 43.62,14.03 | I2C2_SDA.TP 43.88,14.03 43.62,14.03
N$1
  Top 0.254: U7.4 29.43,82.23 R16.1
  Top 0.305: U7.4 29.69,82.07 | R18.2 R16.1
N$2
  Top 0.305: R21.2 R19.1 19.14,72.96 U8.4
N$3
  Top 0.305: R3.2 R1.1 8.85,63.69 U1.4
N$4  (via drill 0.38)
  Top 0.61: U15.5 45.47,55.88 45.17,55.59 C44.1 45.17,53.68 v44.45,52.96 | v36.7,49.91 R36.2
  Bottom 0.61: v44.45,52.96 44.45,52.2 42.16,49.91 v36.7,49.91
N$5
  Top 0.61: U12.4 33.16,46.41 arc45 R31.1 32.6,46.23 32,46.23 31.62,45.85 31.62,44.96 31.15,44.49 R30.1
N$6
  Top 0.305: R7.2 R5.1 19.14,63.69 U3.4
N$7
  Top 0.406: R33.1 46.69,39.59 arc45 46.86,39.66 EXT_PWR.A
N$8  (via drill 1)
  Top 1.27: SJ_A/DGND1.1 v50.29,16.38
  Bottom 1.27: v50.29,16.38 51.82,16.38 52.7,17.27 BB1.47
N$9  (via drill 0.38)
  Top 0.61: U15.7 45.47,58.42 45.09,58.04 v45.09,57.15 U15.6 | v45.72,52.96 45.09,52.32 45.09,51.9 R35.2
  Bottom 0.61: v45.09,57.15 45.09,57.02 45.85,56.26 45.85,53.21 v45.72,52.96
N$10
  Top 0.305: U9.4 39.71,82.23 R20.1 R22.2
N$11  (via drill 0.6)
  Top 0.61: U13.1 44.37,45.16 43.94,45.59 43.94,46.61 44.32,46.99 45.19,46.99 U13.3
  Top 0.813: U13.1 46.28,45.16 v47.88,43.56
  Bottom 0.813: v47.88,43.56 47.88,23.75 46.74,22.61 41.66,22.61 40.89,23.37 JP2.2
  pour Top (no thermals): 44.96,46.86 44.96,47.5 44.58,48.26 44.58,49.28 45.72,49.28 45.72,48.26 45.47,47.5 45.47,46.86
N$12  (via drill 0.38)
  Top 0.61: 43.31,59.69 U15.1 43.43,59.69 43.81,59.31 v43.81,58.42 U15.2 | R34.2 39.12,55.37 v39.62,55.88
  Bottom 0.61: v39.62,55.88 40.13,56.39 43.18,56.39 43.81,57.02 v43.81,58.42
N$13
  Top 0.305: R4.2 R2.1 29.43,72.96 U2.4
N$14
  Top 0.254: ADDRESS.6 20.45,24.51 | 20.45,24.51 15.94,24.51 U16.1 | R37.1 20.41,24.47 20.45,24.51
N$15
  Top 0.305: R8.2 R6.1 39.71,72.96 U4.4
N$16
  Top 0.305: U5.18 arc-90 14.81,41.66 13.97,41.66
  Top 0.406: 13.97,41.66 12.95,41.66
  Top 0.61: 12.95,41.66 11.56,43.05 11.56,45.97 10.96,46.57 C15.2 10.96,49.02 R14.1
N$18
  Top 0.254: 22.43,26.8 20.32,26.8 | 20.32,26.8 15.94,26.8 U16.2 | R38.1 20.41,26.71 20.32,26.8
  Top 0.406: 22.43,26.8 ADDRESS.5
N$19
  Top 0.254: ADDRESS.4 20.45,29.59 | 20.45,29.59 18.03,29.59 16.64,28.19 16,28.19 15.43,27.62 U16.3 | R39.1 20.41,29.55 20.45,29.59
  Top 0.406: 16,27.56 U16.3
N$20
  Top 0.406: R32.1 40.69,50 PWR.A
N$21
  Top 0.254: ~W.2 9.65,22.23 11.81,24.38 11.81,26.04 11.56,26.29 U16.7
N$22
  Top 0.254: ~W.1 12.19,18.07 R40.1
N$23  (via drill 0.38)
  Top 0.61: U12.3 38.77,46.41 C34.1
  Top 0.813: v41.02,45.34 40.51,45.85 39.33,45.85 C34.1
  Bottom 0.813: JP1.2 43.94,31.24 43.94,40.77 43.43,41.27 43.43,42.93 v41.02,45.34
N$24
  Top 0.305: U5.22 U5.21
N$32
  Top 0.61: C40.2 33.19,59.98 32.89,59.69 U14.5
N$33
  pour Top (no thermals): 38.35,33.91 37.72,33.91 36.83,33.4 34.8,33.4 34.8,35.18 36.83,35.18 37.72,34.42 38.35,34.42
N$34
  pour Top (no thermals): 38.35,31.37 37.72,31.37 36.83,30.61 34.8,30.61 34.8,32.38 36.83,32.38 37.72,31.88 38.35,31.88
N$39
  Top 0.305: R17.2 R15.1 9.12,74.15 9.03,74.15 9.02,74.17 | 9.02,74.3 9.02,74.17 | 9.02,74.17 9.02,72.77 9.04,72.77 U6.4
N$40  (via drill 0.38)
  Top 0.254: C11.2 R10.1
  Top 0.305: U5.24 14.86,48.39 v13.46,49.78 | v13.46,52.32 10.79,54.99 R10.1
  Bottom 0.305: v13.46,49.78 v13.46,52.32
N$41  (via drill 0.38)
  Top 0.254: R11.1 C12.2
  Top 0.305: U5.1 v9.02,46.35 | v17.02,54.86 18.63,54.86 C12.2
  Bottom 0.305: v9.02,46.35 9.4,46.74 13.59,46.74 15.24,48.39 15.24,53.09 v17.02,54.86
N$42  (via drill 0.38)
  Top 0.254: R12.1 C13.2
  Top 0.305: U5.2 v10.41,44.96 | v29.21,63.25 C13.2
  Bottom 0.305: v10.41,44.96 13.97,44.96 18.03,48.9 18.03,51.94 21.97,55.88 24.13,55.88 25.65,57.4 27.69,57.4 29.21,58.93 v29.21,63.25
N$43  (via drill 0.38)
  Top 0.254: R13.1 C14.2
  Top 0.305: U5.3 9.91,44.32 v10.41,43.81 | v37.59,64.26 37.68,64.17 C14.2
  Bottom 0.305: v10.41,43.81 13.84,43.81 18.8,48.77 18.8,51.56 21.72,54.48 26.8,54.48 29.97,57.66 29.97,62.61 31.62,64.26 v37.59,64.26
VBIAS  (via drill 0.38)  (1 unrouted)
  Top 0.254: VBIAS.TP 46.23,50.67 45.85,50.67
  Top 0.61: C43.1 46.86,51.56 | 46.86,51.56 46.86,51.18 46.35,50.67 45.85,50.67 44.07,50.67 43.43,51.31 43.43,51.78 R35.1 | 46.86,51.56 48.13,52.83 v48.13,53.59 | U4.3 43.1,72.69 v44.2,73.79 | U2.3 32.82,72.69 v34.04,73.91 35.31,73.91 36.45,72.77 v38.73,72.77 | 22.1,63.5 22.61,63.5 v23.5,64.39 | U1.3 12.24,63.42 13.34,64.52 14.48,64.52 15.49,63.5 v18.16,63.5
  Bottom 0.61: v48.13,53.59 48.13,72.14 46.48,73.79 v44.2,73.79 43.18,72.77 v38.73,72.77 | v34.04,73.91 32.89,72.77 28.57,72.77 27.56,71.75 27.56,65.53 26.42,64.39 v23.5,64.39 | v23.5,64.39 23.37,64.39 | v18.16,63.5 22.61,63.5 v23.5,64.39
VDD_5V  (via drill 0.38)
  Top 0.813: BB1.52 44.32,24.13 43.69,24.77 JP2.3 | v45.59,35.43 U11.8
  Bottom 0.813: JP2.3 45.59,26.92 v45.59,35.43 | BB1.52 BB1.51
VDD_EXT
  Top 0.254: 37.59,36.54 37.59,35.69 37.85,35.43 U11.1 41.66,38.02 PWR_EXT.1
  Top 0.406: 37.59,36.54 R29.1 | R33.2 44.79,37.85 43.94,37.85 42.29,39.5 PWR_EXT.1
  Bottom 0.813: JP2.1 39.62,26.04 39.62,33.53 41.4,35.31 41.4,39.24 PWR_EXT.1
VDRIVE  (via drill 0.38)
  Top 0.254: R42.2 v10.67,30.99 | R24.2 v29.72,35.18 | R25.2 v31.75,35.18 | R9.2 v15.11,36.45 | R41.2 16.47,23.11 v17.65,23.11 | R40.2 v8.76,17.65
  Top 0.305: R37.2 v17.65,23.11 | R38.2 v17.65,25.53 | R39.2 v17.65,28.19
  Top 0.813: v24.38,35.43 24.38,36.58 | v18.67,39.88 17.27,39.88 | v6.6,25.15 7.75,25.15 v7.75,23.88
  Route15 1.422: BB1.50 43.81,21.59
  pour Route15: 0,5.89 0,47.5 5.08,47.5 arc-90 7.37,45.21 arc90 12.06,40.51 19.05,40.51 arc91 19.3,40.64 arc-90 19.43,40.77 28.19,40.76 arc-90 33.4,36.19 33.4,29.34 arc90 40.26,22.48 44.32,22.48 arc-90 45.09,21.72 45.09,18.06 arc91 46.26,17.04 54.61,17.02 54.69,6.54 arc-90 48.2,0 33.66,0 33.66,20.32 15.88,20.32 15.88,5.89
  pour Top (no thermals): 24.77,38.86 24.64,37.85 23.88,37.08 23.88,36.07 24.77,36.07 24.77,37.08 25.02,37.85
  pour Top (no thermals): 14.22,40.51 14.22,40.26 15.88,40.13 16.51,39.12 18.03,39.12 18.03,40.51
  pour Top (no thermals): 9.27,25.27 10.16,25.27 10.16,24.77 9.27,24.77 9.14,24.77 8.26,24.51 7.24,24.51 7.24,25.53 8.26,25.53 9.14,25.27
VREF  (via drill 0.38)
  Top 0.254: VREF.TP 37.08,54.23 37.08,52.74
  Top 0.61: C42.1 40.6,54.44 40.26,54.1 40.26,53.09 39.88,52.7 39.16,52.7 R34.1 37.08,52.74 35.27,52.74 34.42,53.59 R36.1 29.84,53.59 29.84,52.96 27.69,50.8 | C24.1 28.32,46.32 28.32,46.99 27.69,47.62 27.69,50.8 | R14.2 10.96,50.8 | 10.96,50.8 27.69,50.8 | 10.96,50.8 8.13,50.8 6.35,52.58 v6.35,53.59 | R20.2 38.01,84.96 37.5,85.47 v27.69,85.47 27.73,85.38 R16.2 | R19.2 v16.38,74.42 | v6.35,73.15 6.73,73.15 7.11,73.53 7.11,74.38 R15.2
  Bottom 0.61: v6.35,53.59 v6.35,73.15 6.35,74.42 | v16.38,74.42 15.37,74.42 14.99,74.8 12.45,74.8 12.06,74.42 6.35,74.42 | 6.35,74.42 6.35,75.95 15.88,85.47 v27.69,85.47
  pour Top (no thermals): 27.94,44.32 27.94,44.7 27.81,45.72 27.81,46.74 28.96,46.74 28.96,45.72 28.19,44.96 28.19,44.32
VREF_PRE  (via drill 0.38)
  Top 0.305: VREF_PRE.TP C38.1
  Top 0.61: 29.09,59.18 C38.1 | U15.3 40.51,57.15 v40.13,57.53 | v33.4,58.55 33.27,58.42 U14.6
  Top 0.813: 29.09,59.18 29.85,58.42 U14.6
  Bottom 0.61: v40.13,57.53 39.12,58.55 v33.4,58.55
VSS_EXT
  Bottom 0.813: PWR_EXT.3 36.58,29.97 JP1.3
VSS_PRE
  Top 0.254: 43.99,28.75 45.64,28.75 VSS_PRE.TP
  Top 0.813: JP1.1 43.99,28.75 U11.5
  pour Top (no thermals): 44.45,31.37 44.96,31.37 45.97,30.61 48.01,30.61 48.01,32.38 45.72,32.38 44.96,31.88 44.45,31.88
~RST  (via drill 0.38)
  Top 0.254: R24.1 28.87,37.34 27.94,37.34 27.41,37.87 | 27.41,37.87 U10.15 | U5.8 11.51,41.07 v12.06,40.51 | v12.06,37.59 12.06,36.87 R9.1 v10.54,36.45 | 27.41,37.87 27.43,37.9 27.43,39.5 26.92,40.01 v26.67,40.01 | 11.43,8.64 v8.51,11.56
  Top 0.61: 11.43,8.64 12.39,8.64 RESET.A' RESET.A
  Bottom 0.254: v12.06,40.51 v12.06,37.59 17.53,37.59 18.03,37.08 20.45,37.08 20.7,37.34 25.65,37.34 26.04,37.72 26.04,39.37 v26.67,40.01 | v8.51,11.56 7.37,12.7 7.37,21.34 9.91,23.88 9.91,35.81 v10.54,36.45

### Text on the board
tPlace: + | + | Jon Newman / r1.0